# Altium project 主控板.PrjPCB
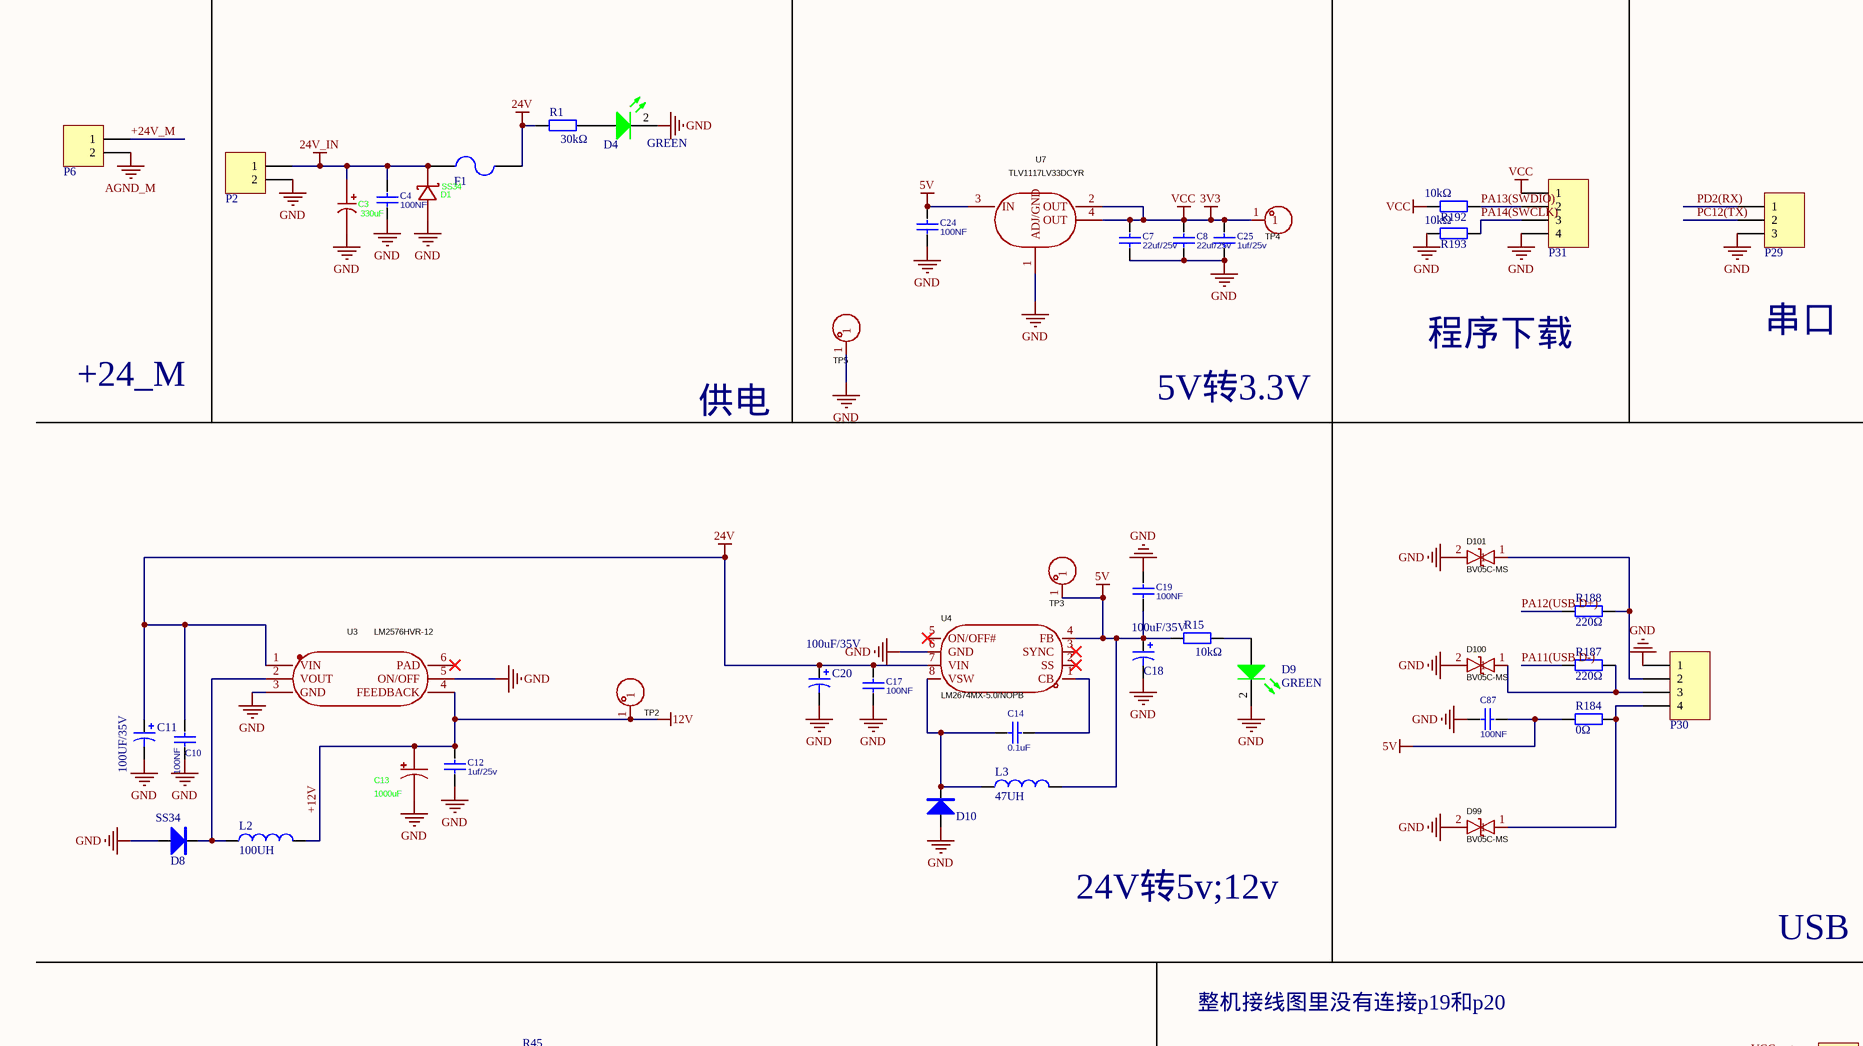
[diagram p0: 主控板0413.SchDoc, top left]
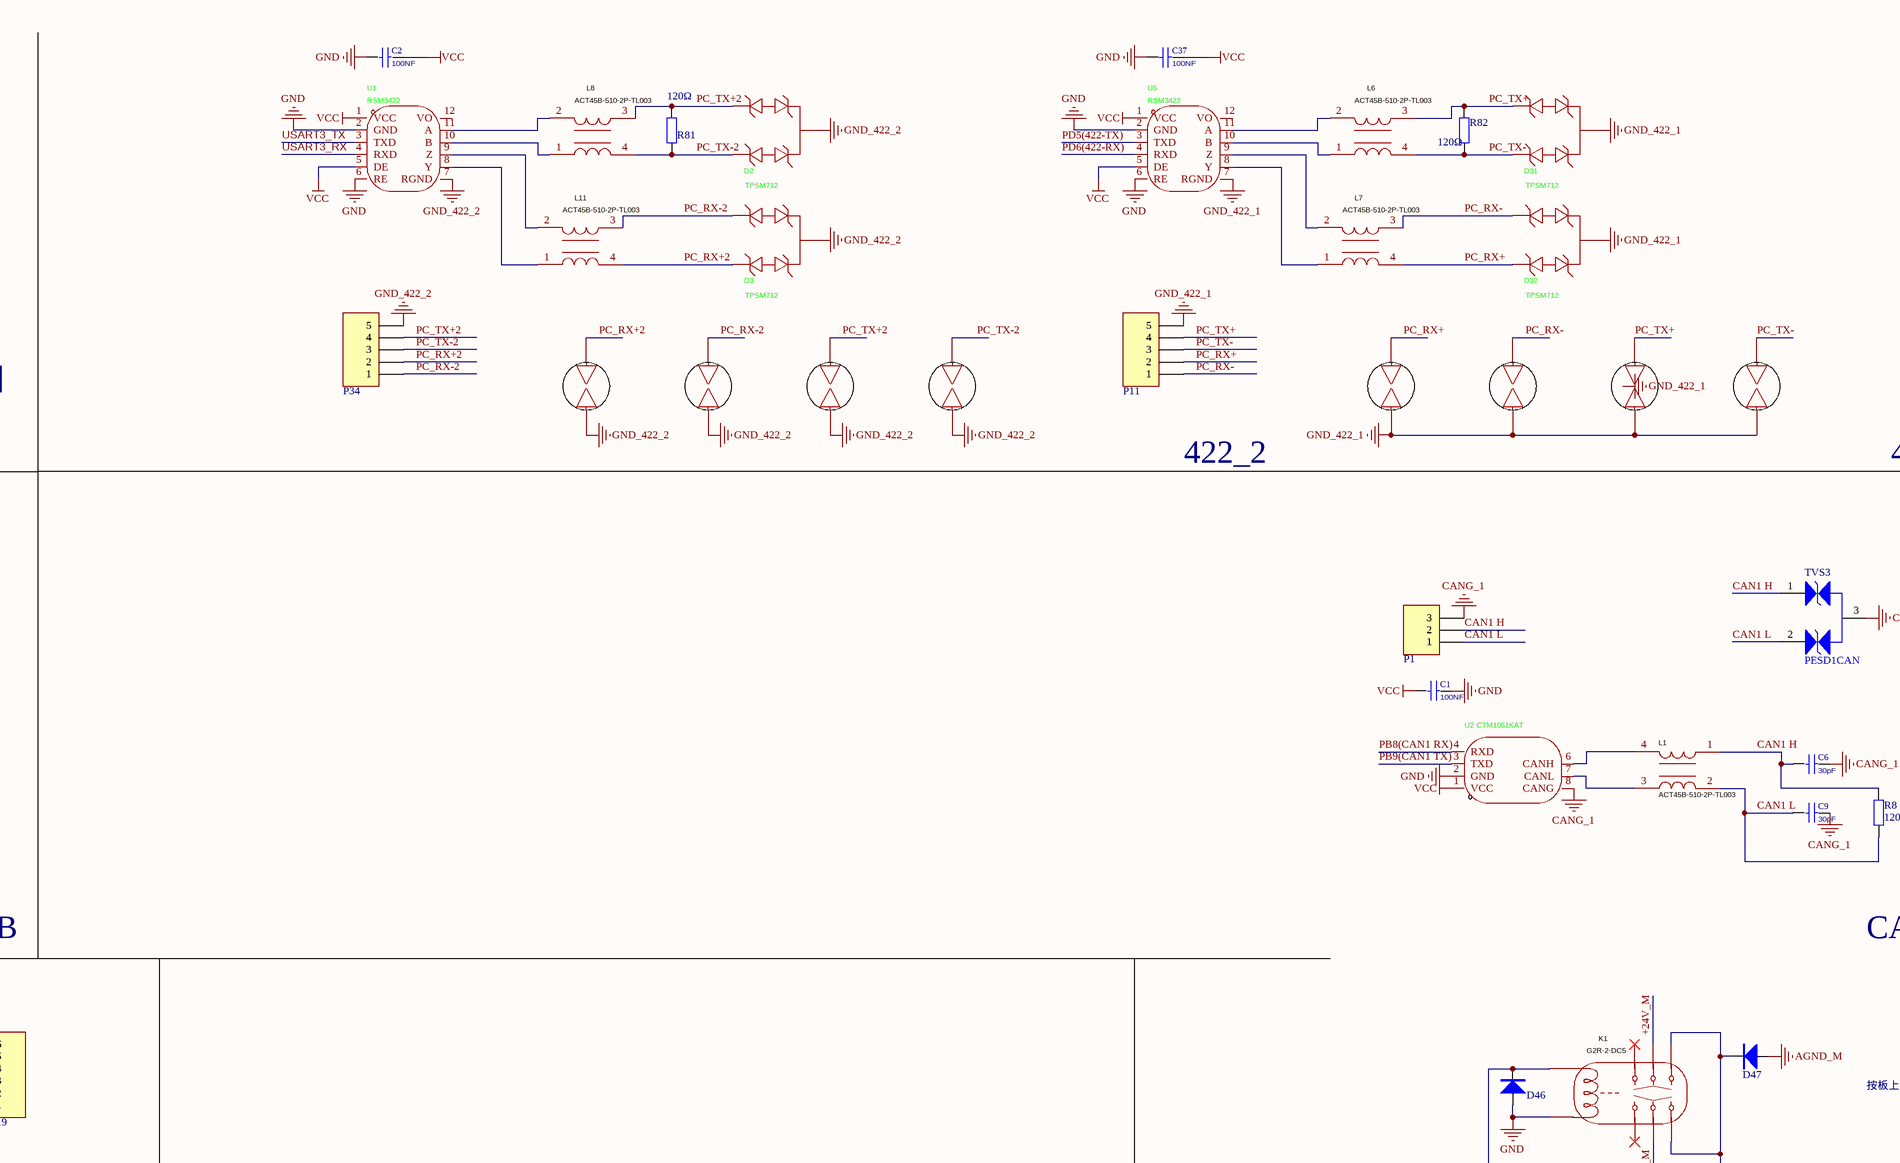
[diagram p1: 主控板0413.SchDoc, top middle]
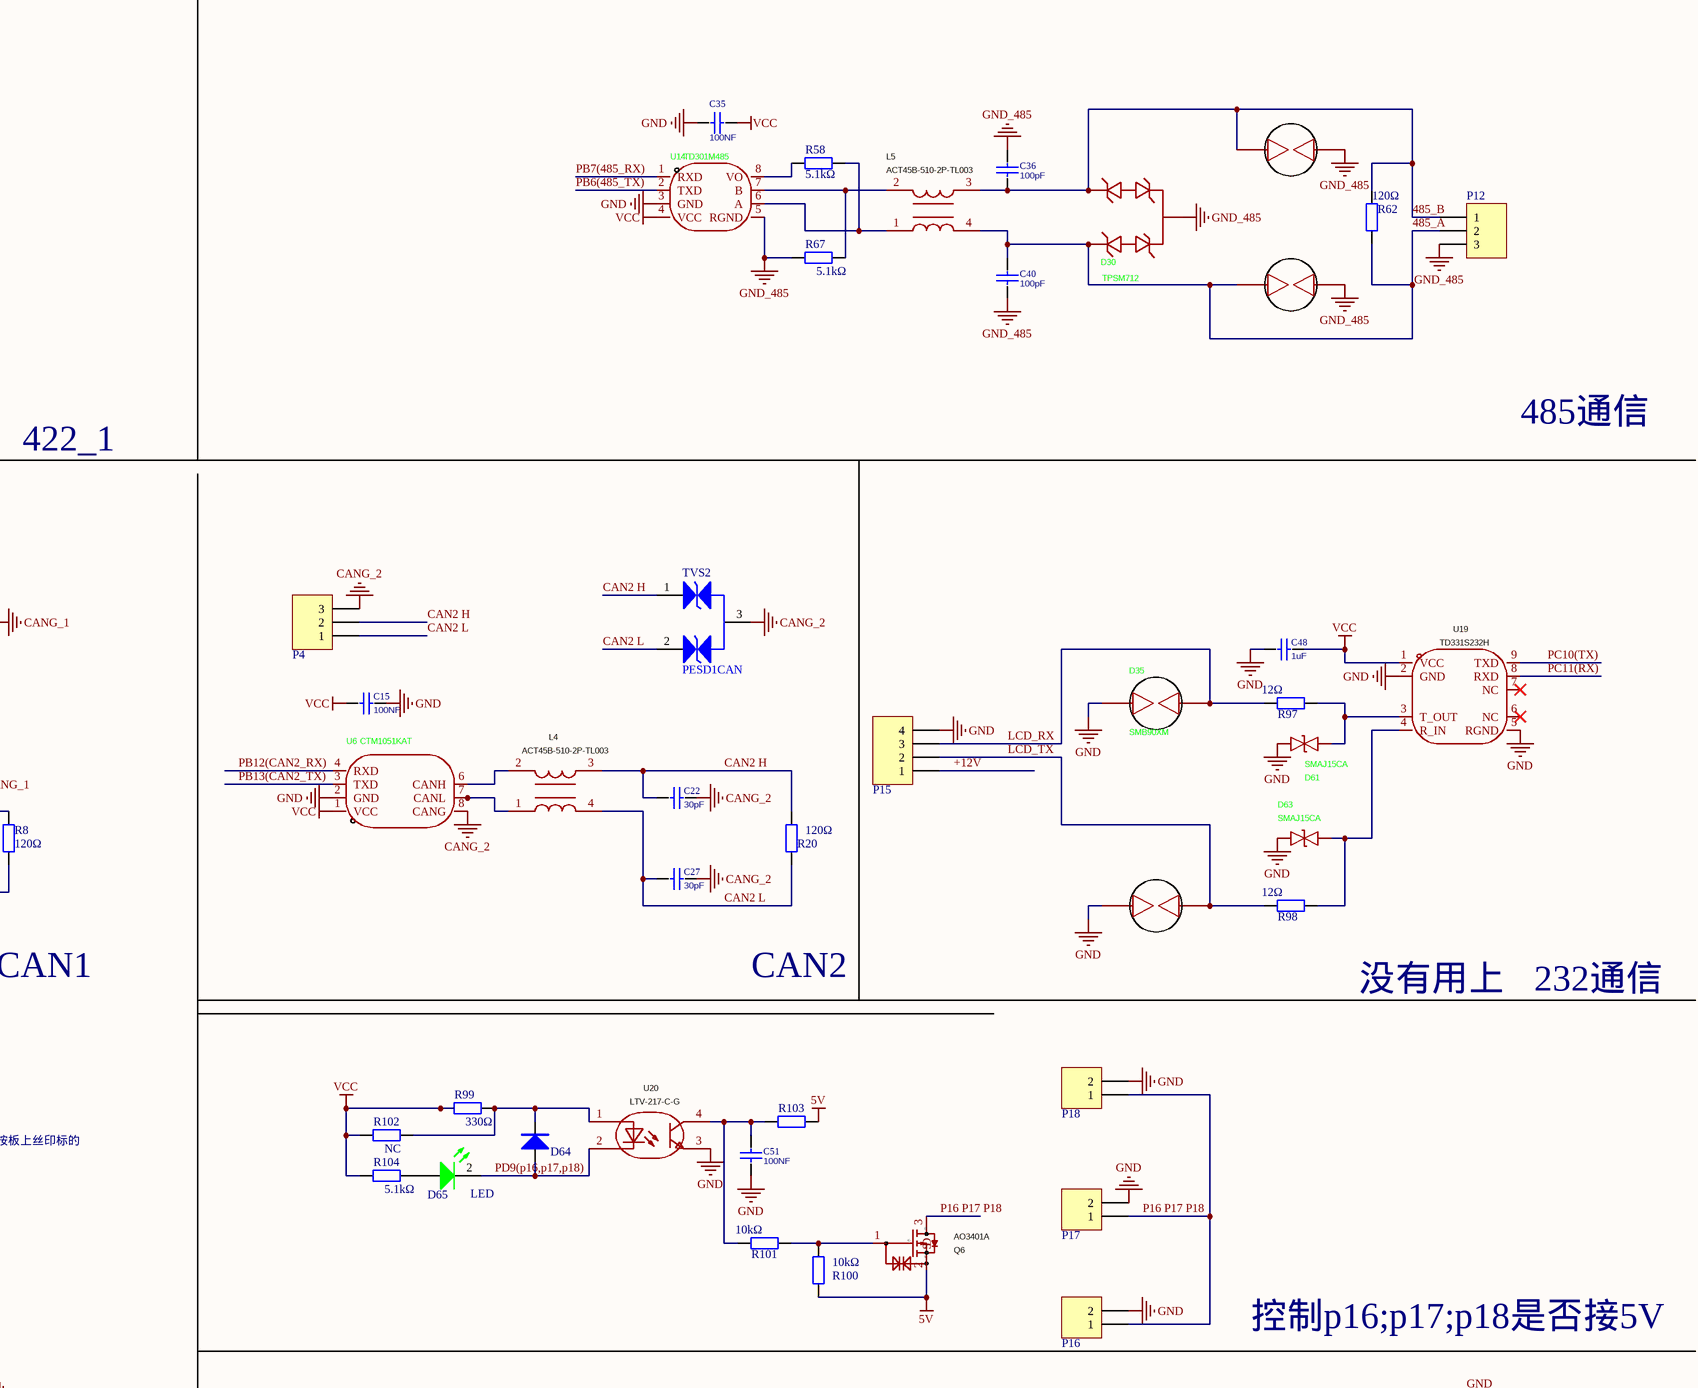
[diagram p2: 主控板0413.SchDoc, top right]
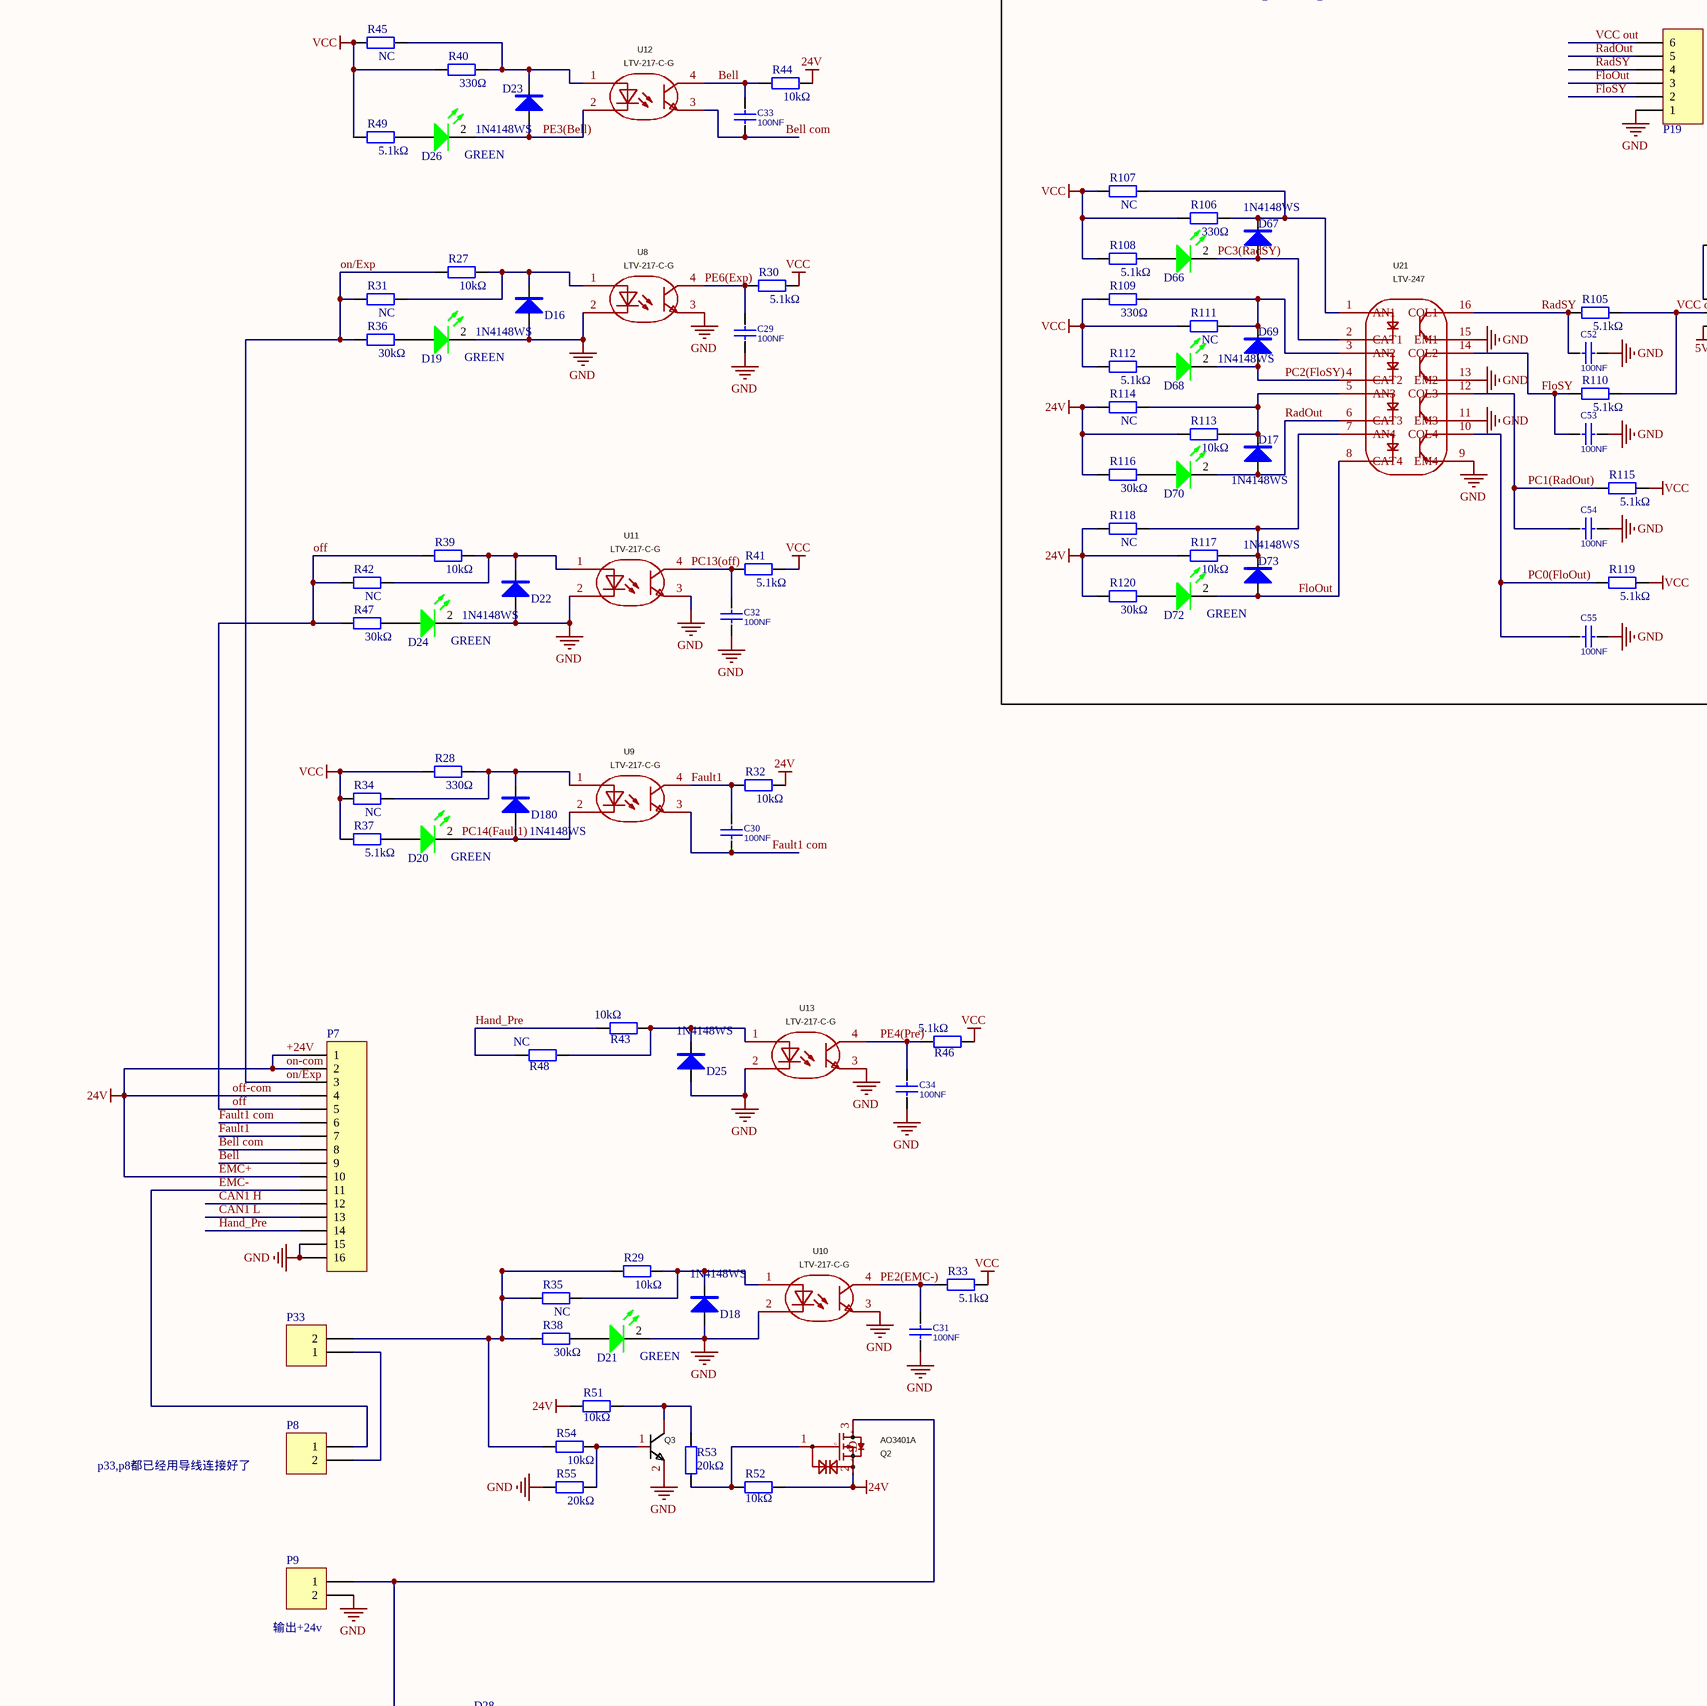
[diagram p3: 主控板0413.SchDoc, centre left]
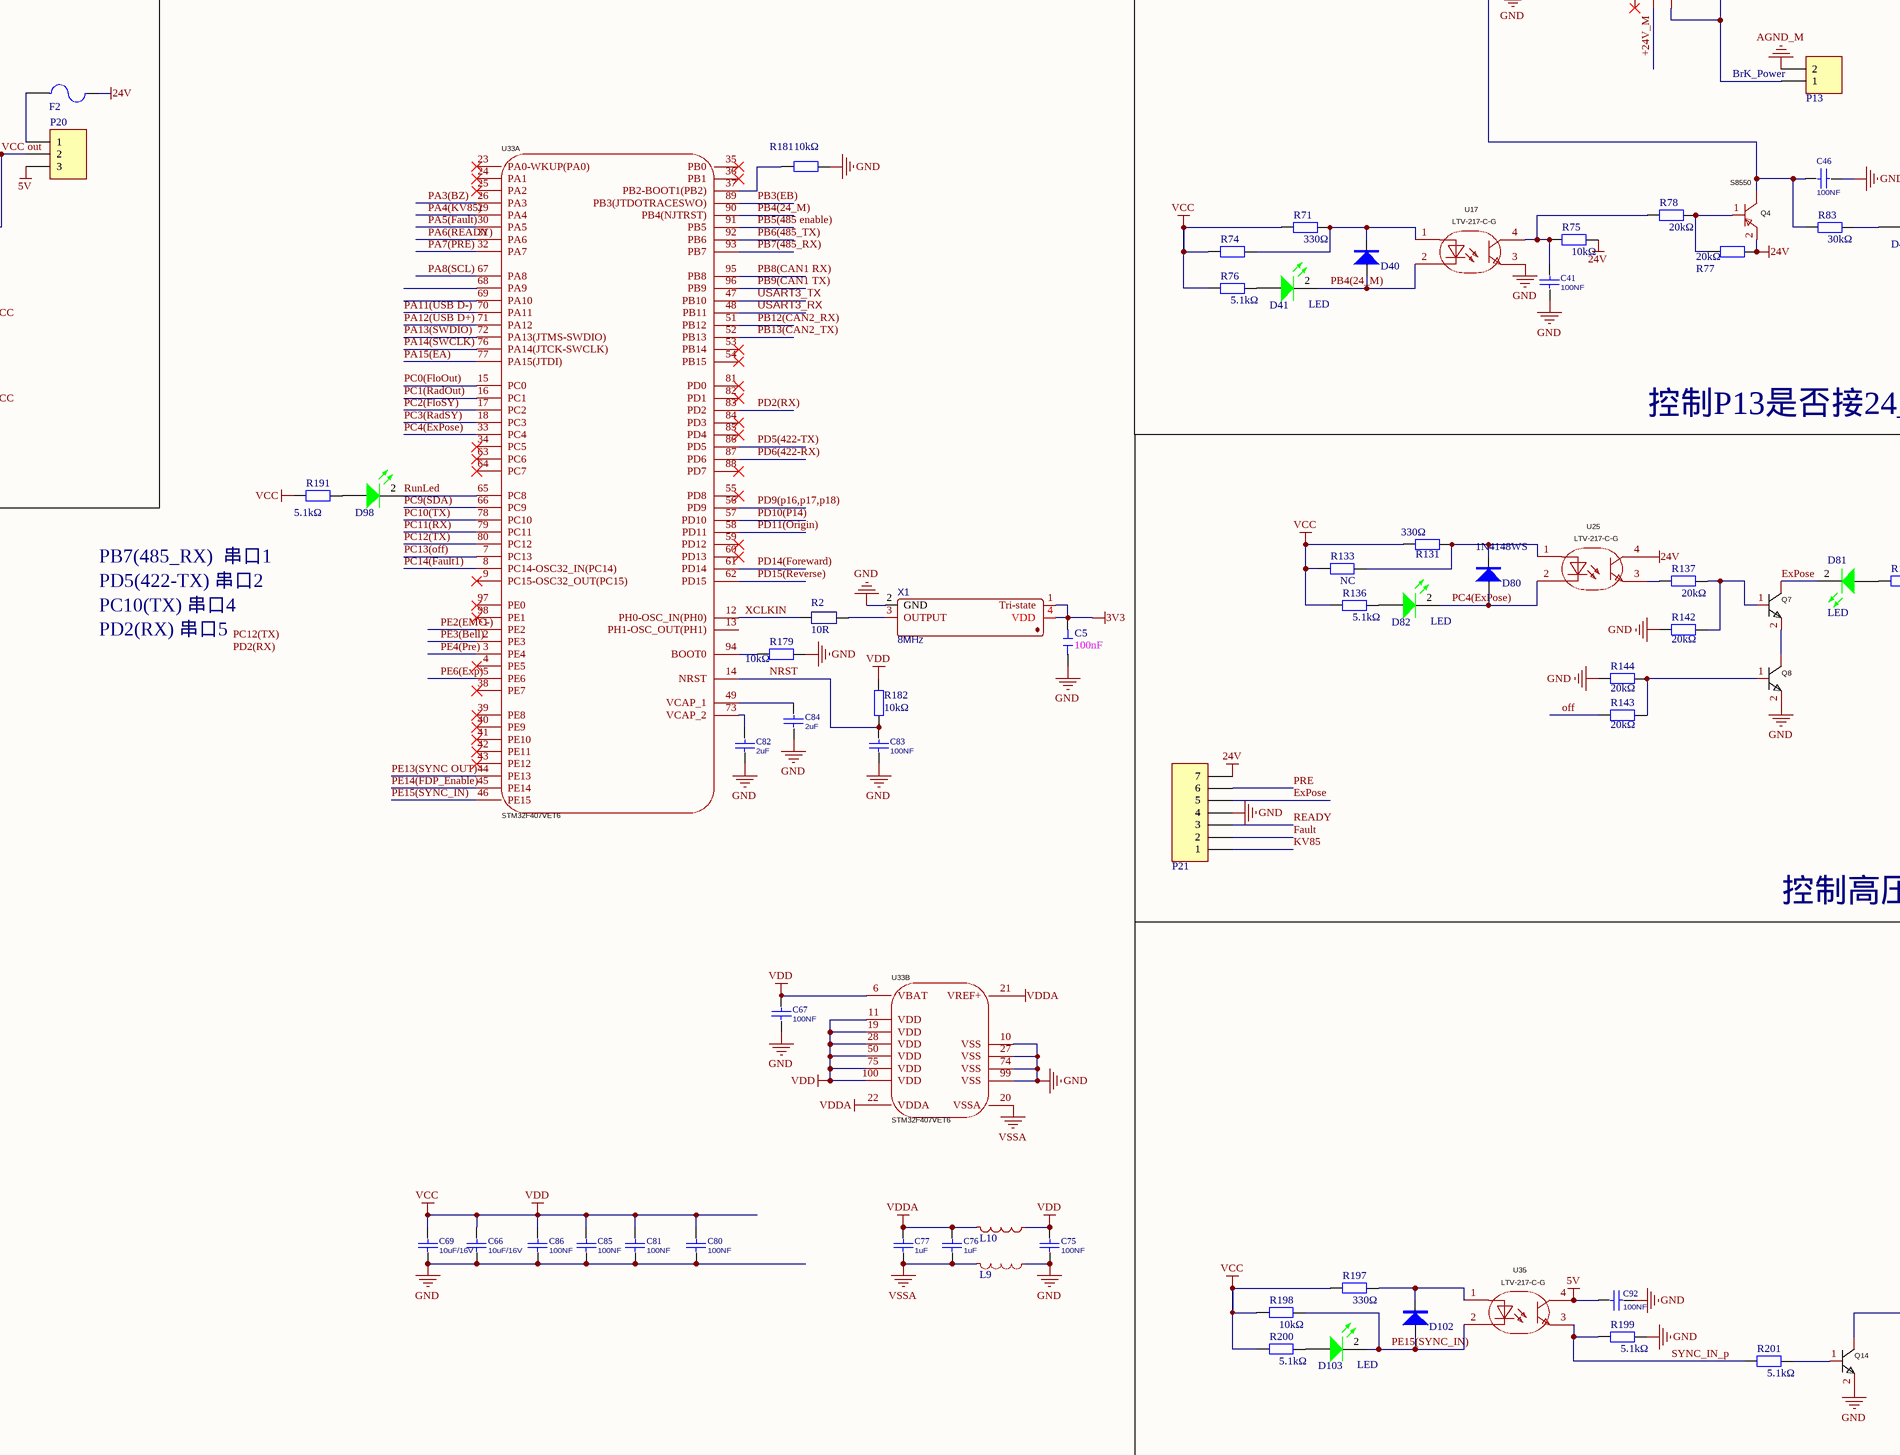
[diagram p4: 主控板0413.SchDoc, centre middle]
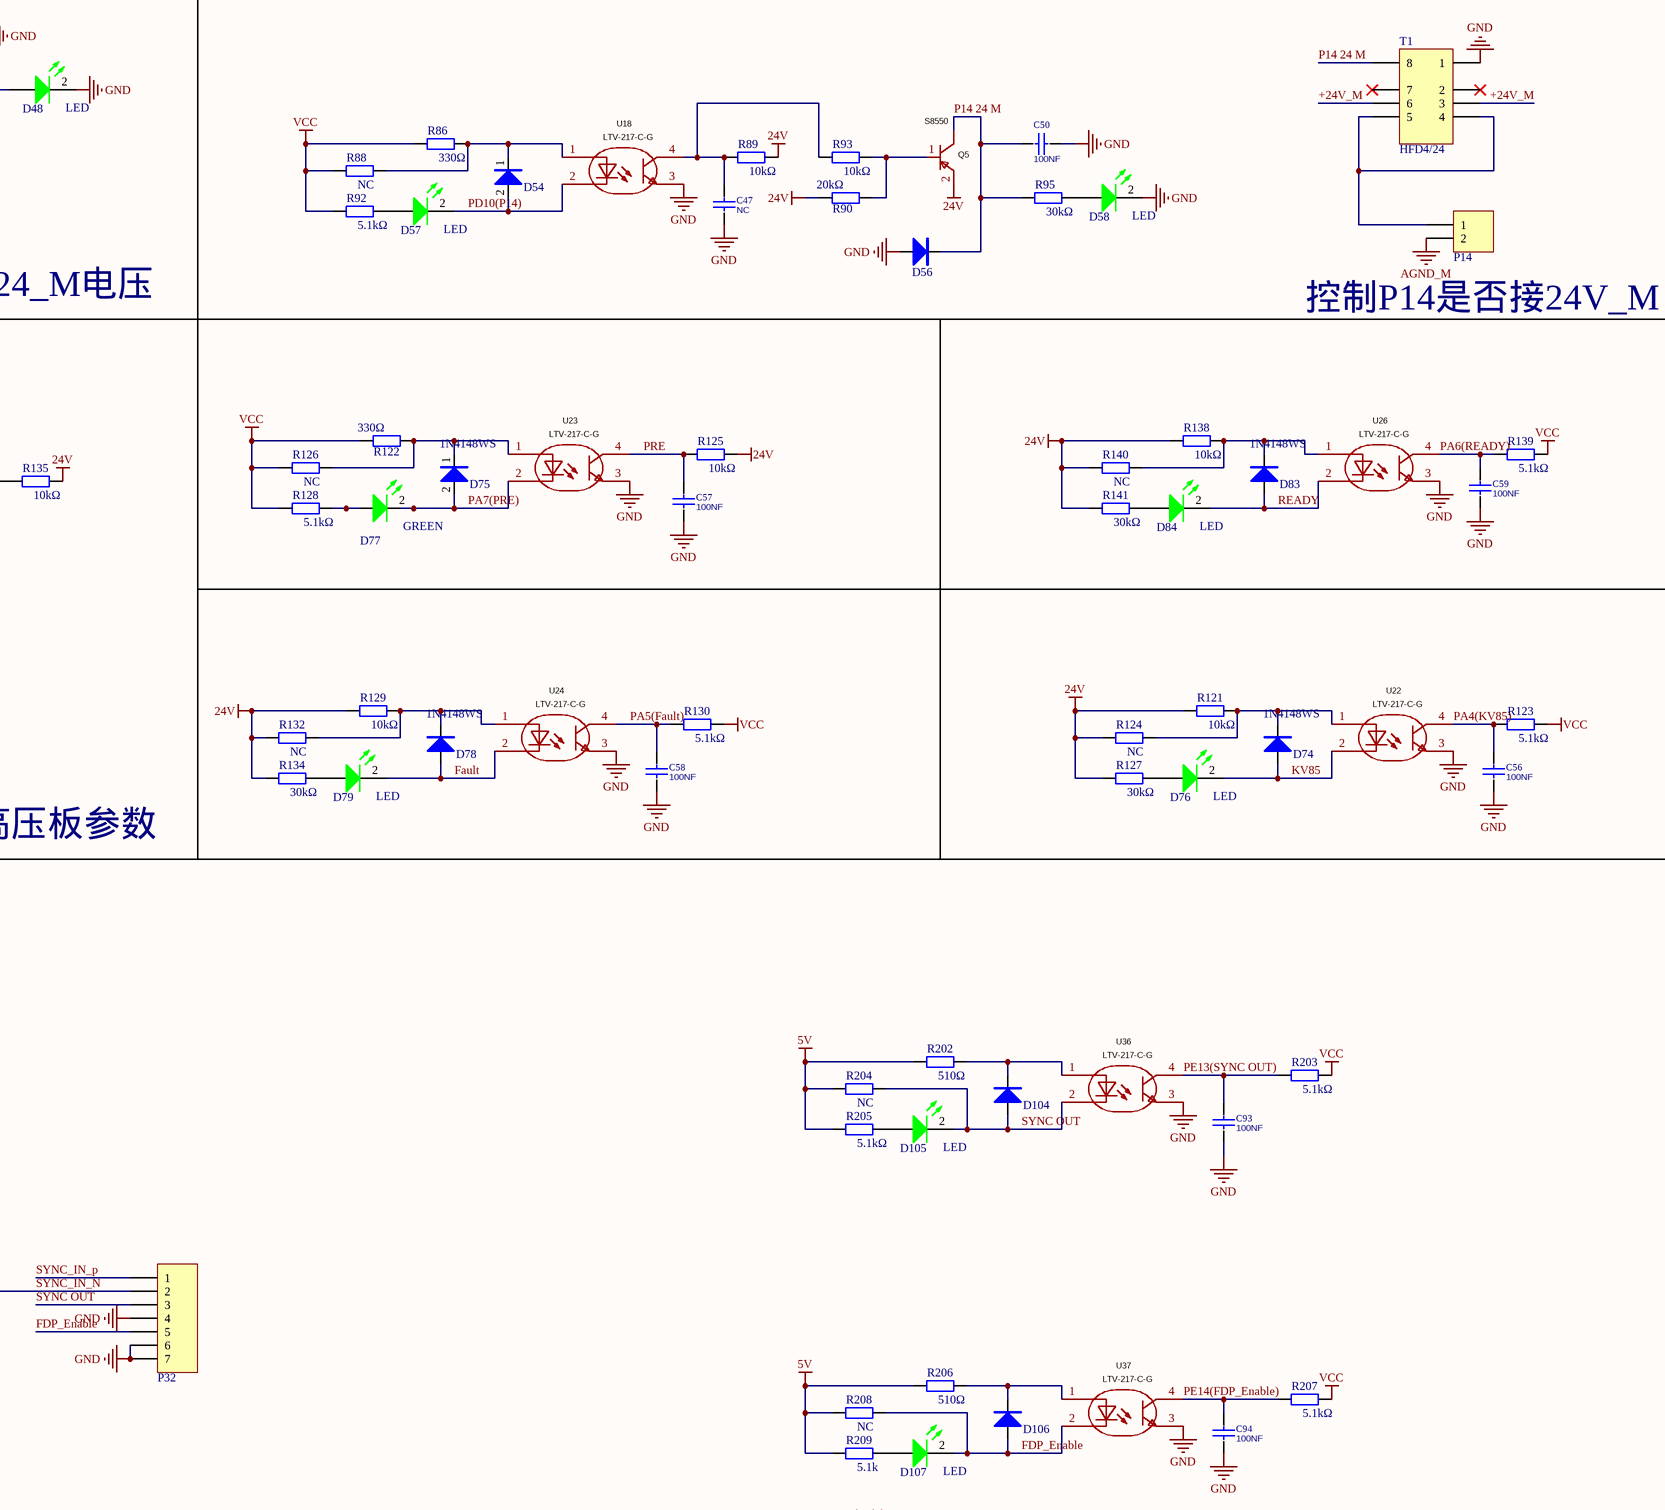
[diagram p5: 主控板0413.SchDoc, centre right]
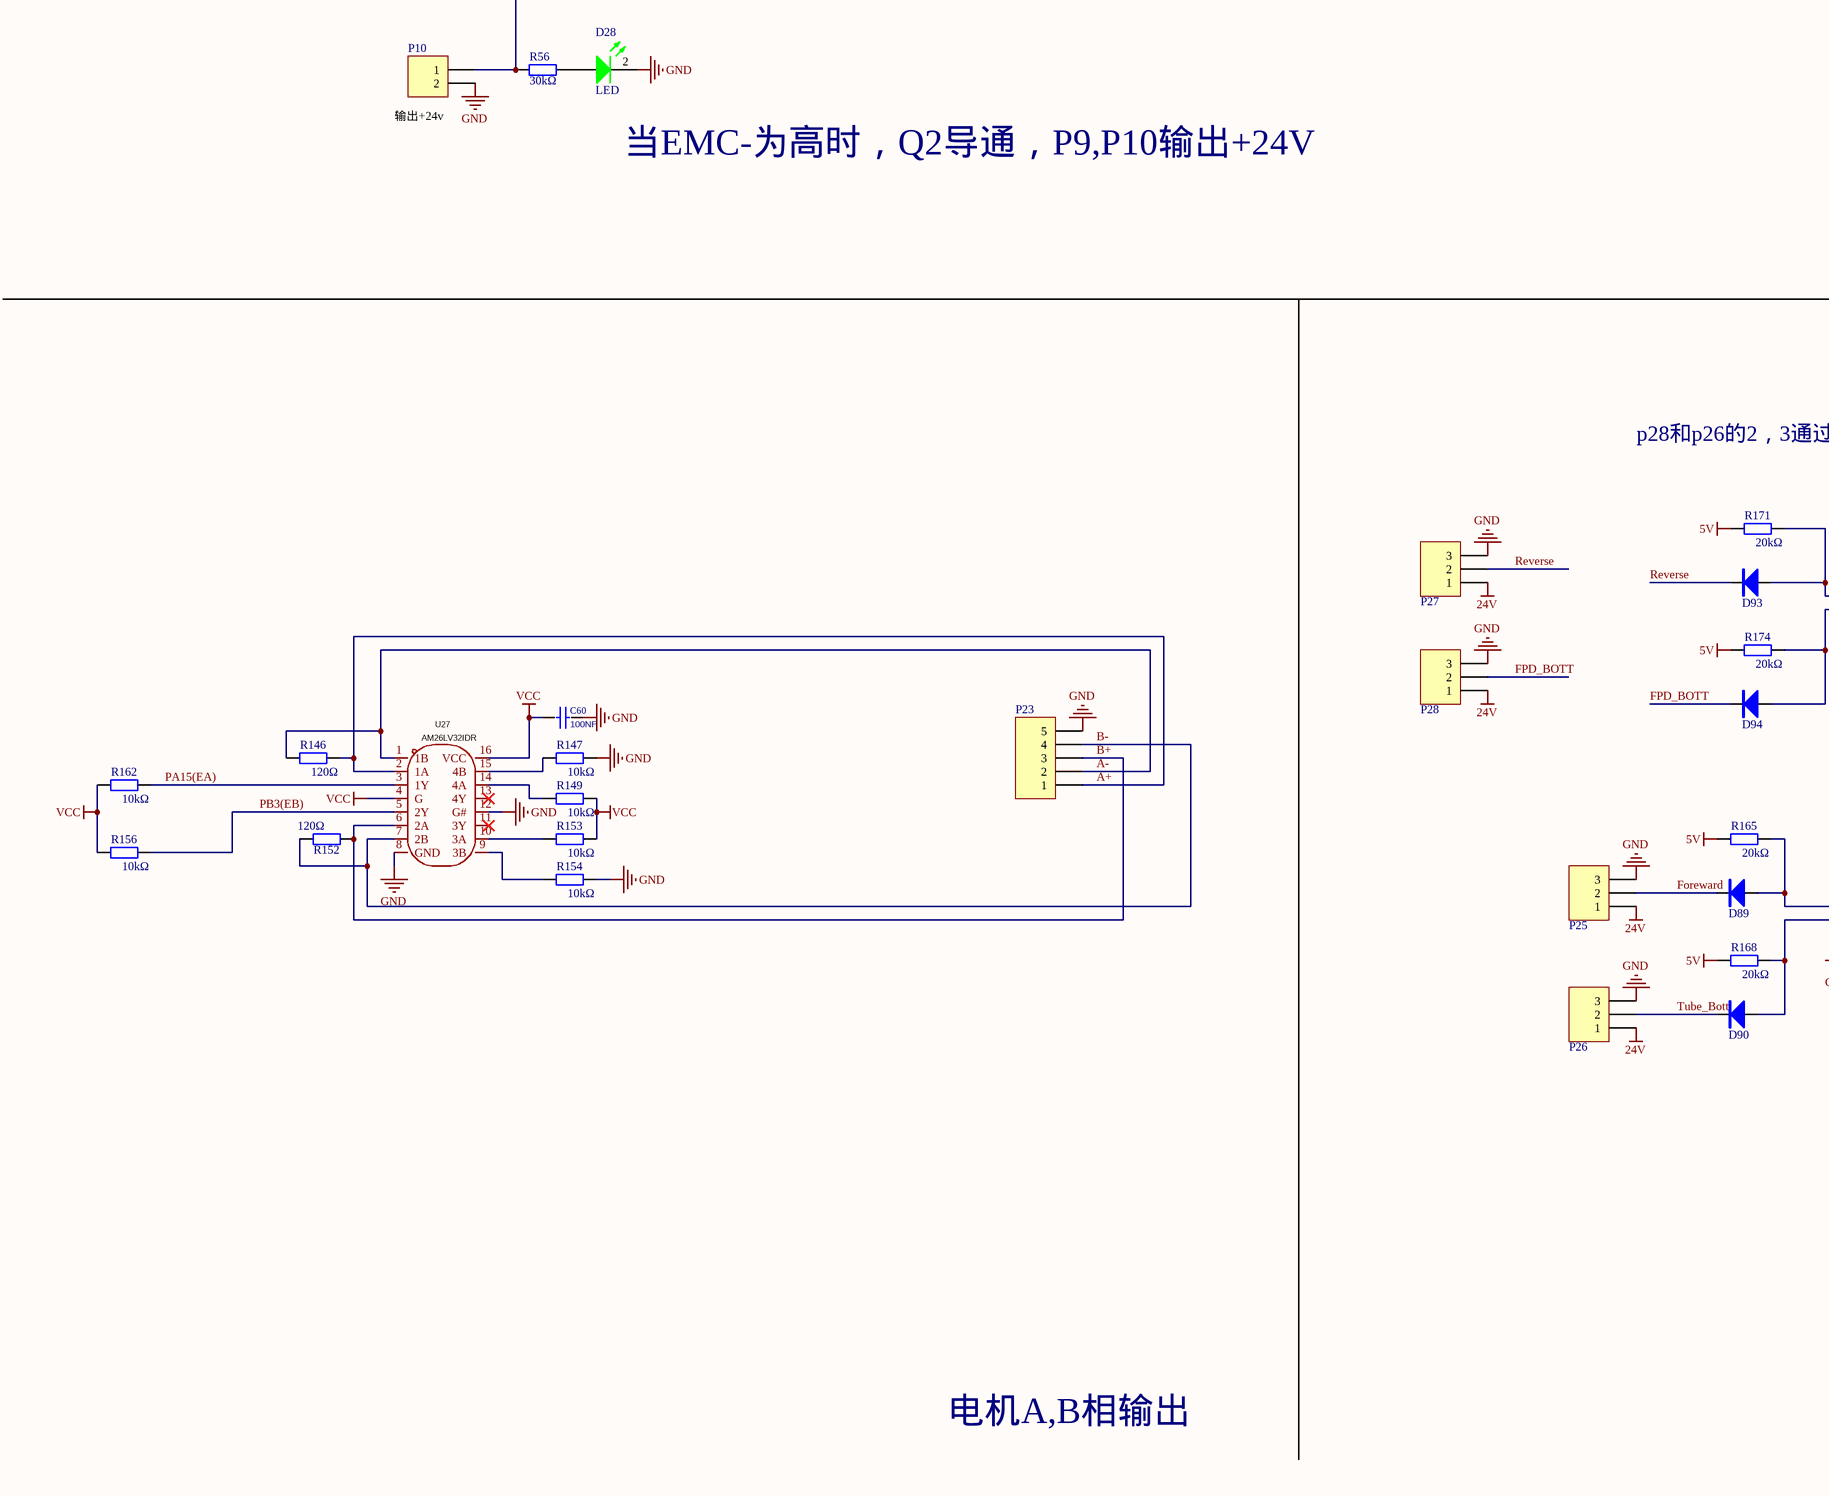
[diagram p6: 主控板0413.SchDoc, bottom left]
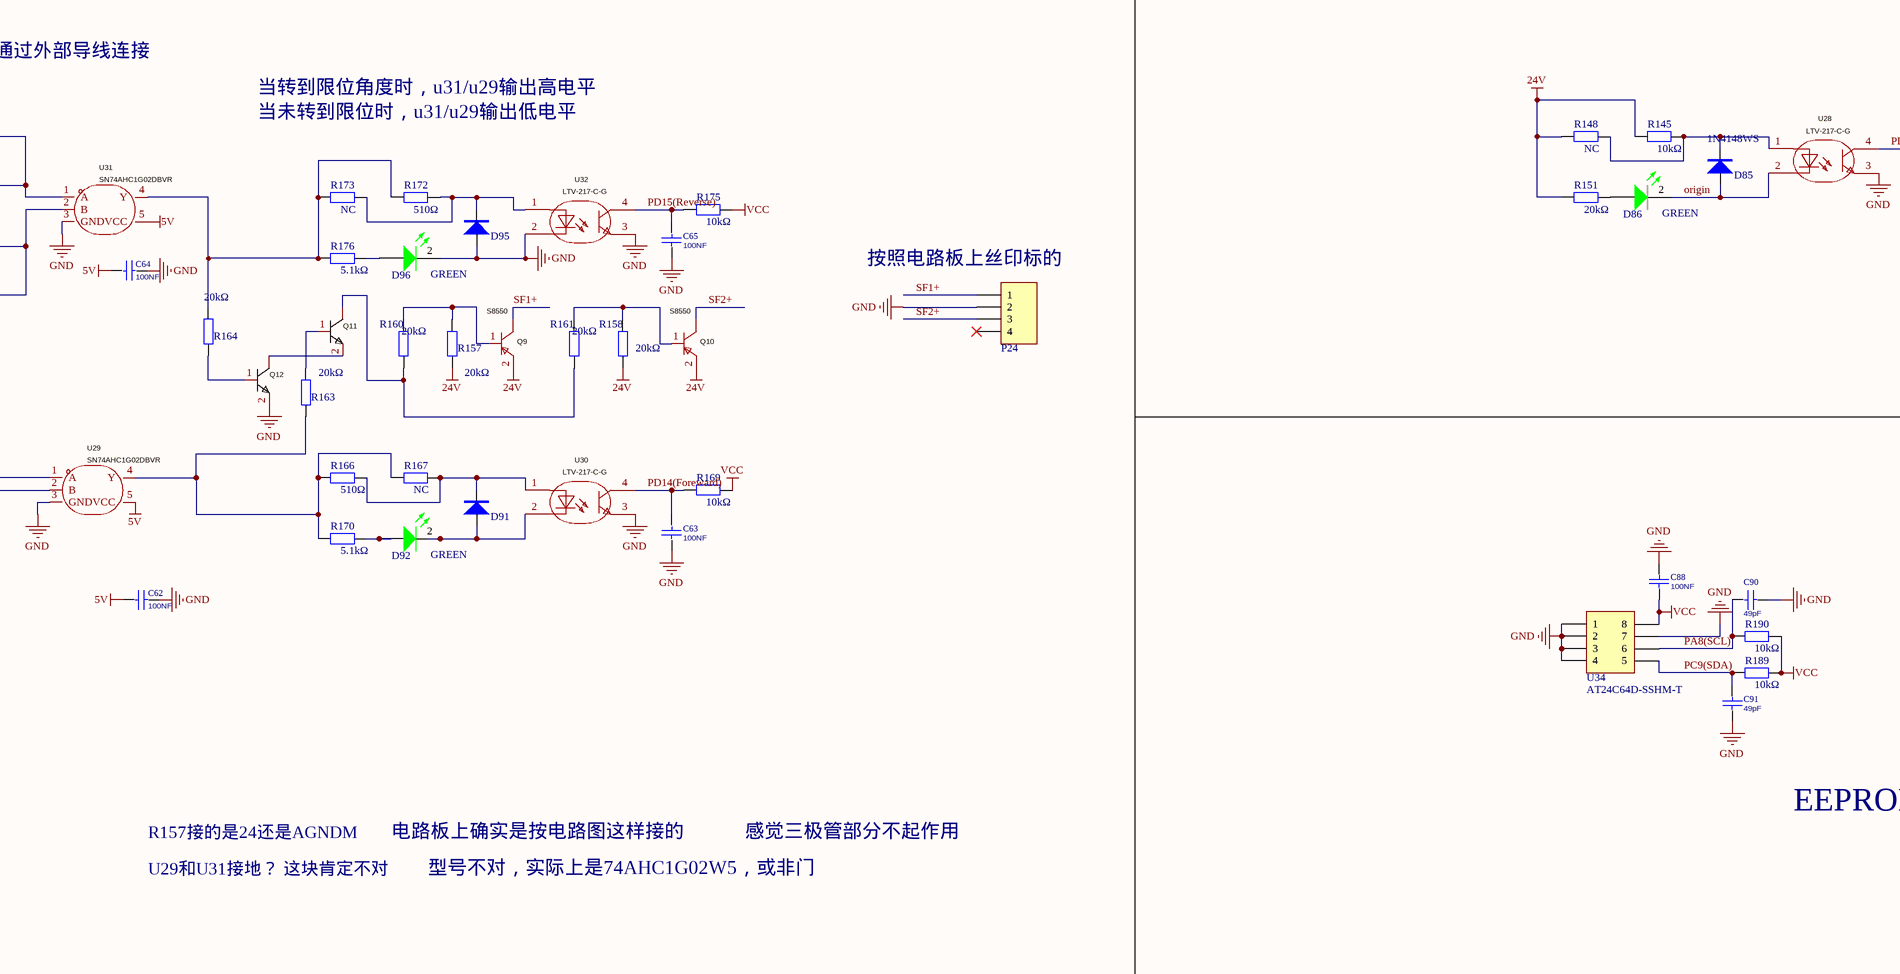
[diagram p7: 主控板0413.SchDoc, bottom middle]
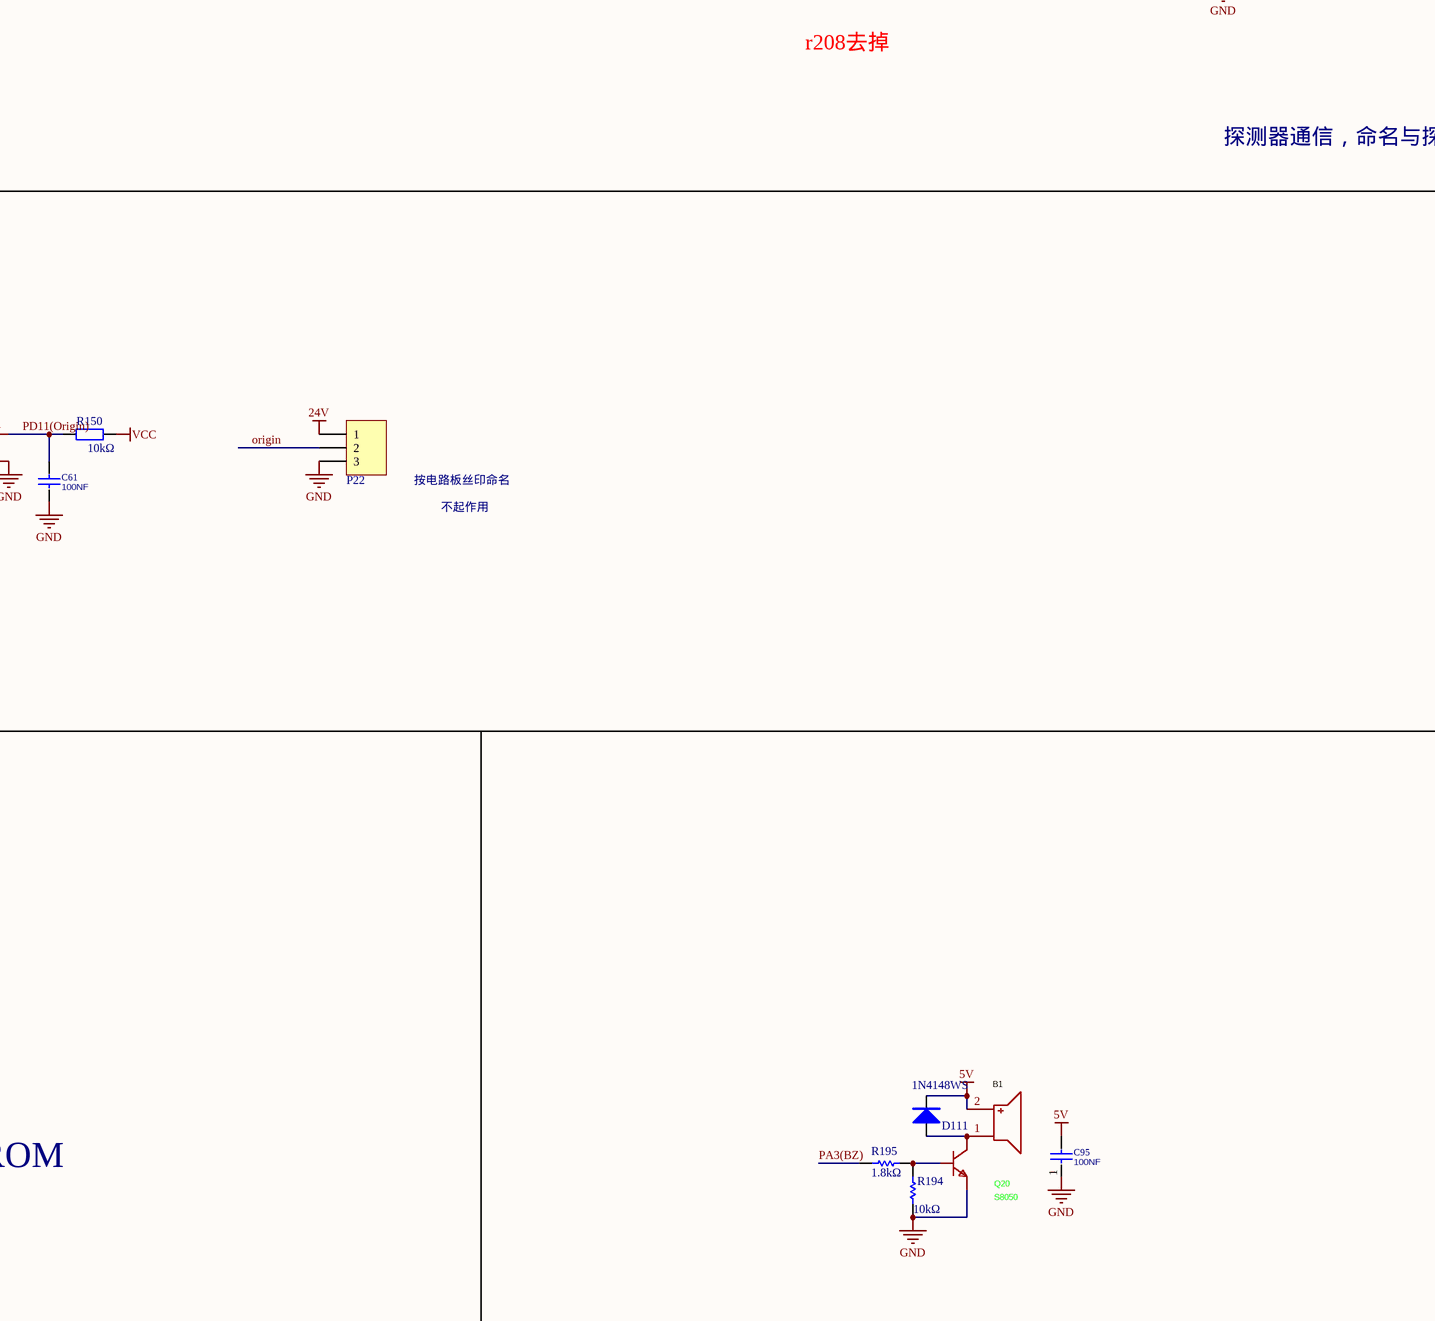
[diagram p8: 主控板0413.SchDoc, bottom right]
1 sheet, 421 parts. Net scope: global (net labels, ports and power ports of the same name join across sheets).
Board file: 主控板0415 .PcbDoc

## Sheet 主控板0413.SchDoc
size E

### Parts
B1  (no value)  [CPA5]
C1  100NF  [C0603]
C2  100NF  [C0603]
C3  330uF  [CAP-TH_BD8.0-P3.50-D0.5-FD]
C4  100NF  [C1206]
C5  100nF  [C0603]
C6  30pF  [C0603]
C7  22uf/25v  [C0805]
C8  22uf/25v  [C0805]
C9  30pF  [C0603]
C10  100NF  [C0603]
C11  100UF/35V  [CAP10]
C12  1uf/25v  [C0603]
C13  1000uF  [CAP-TH_BD10.0-P5.00-D1.0-FD]
C14  0.1uF  [C0603]
C15  100NF  [C0603]
C17  100NF  [C1206]
C18  100uF/35V  [CAP10]
C19  100NF  [C0603]
C20  100uF/35V  [CAP10]
C22  30pF  [C0603]
C24  100NF  [C0603]
C25  1uf/25v  [C0603]
C27  30pF  [C0603]
C29  100NF  [C0603]
C30  100NF  [C0603]
C31  100NF  [C0603]
C32  100NF  [C0603]
C33  100NF  [C0603]
C34  100NF  [C0603]
C35  100NF  [C0603]
C36  100pF  [C0603]
C37  100NF  [C0603]
C40  100pF  [C0603]
C41  100NF  [C0603]
C46  100NF  [C0603]
C47  NC  [C0603]
C48  1uF  [C0603]
C50  100NF  [C0603]
C51  100NF  [C0603]
C52  100NF  [C0603]
C53  100NF  [C0603]
C54  100NF  [C0603]
C55  100NF  [C0603]
C56  100NF  [C0603]
C57  100NF  [C0603]
C58  100NF  [C0603]
C59  100NF  [C0603]
C60  100NF  [C0603]
C61  100NF  [C0603]
C62  100NF  [C0603]
C63  100NF  [C0603]
C64  100NF  [C0603]
C65  100NF  [C0603]
C66  10uF/16V  [C0603]
C67  100NF  [C0603]
C69  10uF/16V  [C0603]
C75  100NF  [C0603]
C76  1uF  [C0603]
C77  1uF  [C0603]
C80  100NF  [C0603]
C81  100NF  [C0603]
C82  2uF  [C0603]
C83  100NF  [C0603]
C84  2uF  [C0603]
C85  100NF  [C0603]
C86  100NF  [C0603]
C87  100NF  [C0603]
C88  100NF  [C0603]
C90  49pF  [C0603]
C91  49pF  [C0603]
C92  100NF  [C0603]
C93  100NF  [C0603]
C94  100NF  [C0603]
C95  100NF  [C0603]
D1  SS34  [SMA_L4.3-W2.6-LS5.2-RD]
D2  TPSM712  [SOT-23-3_L2.9-W1.3-P1.90-LS2.4-BR]
D3  TPSM712  [SOT-23-3_L2.9-W1.3-P1.90-LS2.4-BR]
D4  GREEN  [LED0603]
D5  SMB90XM  [DIO-DT-SMD_L3.2-W1.6]  (value not drawn)
D6  SMB90XM  [DIO-DT-SMD_L3.2-W1.6]  (value not drawn)
D7  SMB90XM  [DIO-DT-SMD_L3.2-W1.6]  (value not drawn)
D8  SS34  [SMA]
D9  GREEN  [LED0603]
D10  SS34  [SMA]  (value not drawn)
D11  SMB90XM  [DIO-DT-SMD_L3.2-W1.6]  (value not drawn)
D12  SMB90XM  [DIO-DT-SMD_L3.2-W1.6]  (value not drawn)
D14  SMB90XM  [DIO-DT-SMD_L3.2-W1.6]  (value not drawn)
D15  SMB90XM  [DIO-DT-SMD_L3.2-W1.6]  (value not drawn)
D16  1N4148WS  [D123-1]
D17  1N4148WS  [D123-1]
D18  1N4148WS  [D123-1]
D19  GREEN  [LED0603]
D20  GREEN  [LED0603]
D21  GREEN  [LED0603]
D22  1N4148WS  [D123-1]
D23  1N4148WS  [D123-1]
D24  GREEN  [LED0603]
D25  1N4148WS  [D123-1]
D26  GREEN  [LED0603]
D28  LED  [LED0603]
D29  SMB90XM  [DIO-DT-SMD_L3.2-W1.6]  (value not drawn)
D30  TPSM712  [SOT-23-3_L2.9-W1.3-P1.90-LS2.4-BR]
D31  TPSM712  [SOT-23-3_L2.9-W1.3-P1.90-LS2.4-BR]
D32  TPSM712  [SOT-23-3_L2.9-W1.3-P1.90-LS2.4-BR]
D33  SMB90XM  [DIO-DT-SMD_L3.2-W1.6]  (value not drawn)
D34  SMB90XM  [DIO-DT-SMD_L3.2-W1.6]  (value not drawn)
D35  SMB90XM  [DIO-DT-SMD_L3.2-W1.6]
D36  SMB90XM  [DIO-DT-SMD_L3.2-W1.6]  (value not drawn)
D40  M7  [D123-1]  (value not drawn)
D41  LED  [LED0603]
D46  M7  [D123-1]  (value not drawn)
D47  M7  [SMA]  (value not drawn)
D48  LED  [LED0603]
D54  M7  [D123-1]  (value not drawn)
D56  M7  [D123-1]  (value not drawn)
D57  LED  [LED0603]
D58  LED  [LED0603]
D61  SMAJ15CA  [SMA_L4.3-W2.6-LS5.0-BI]
D63  SMAJ15CA  [SMA_L4.3-W2.6-LS5.0-BI]
D64  M7  [D123-1]  (value not drawn)
D65  LED  [LED0603]
D66  GREEN  [LED0603]  (value not drawn)
D67  1N4148WS  [D123-1]
D68  GREEN  [LED0603]  (value not drawn)
D69  1N4148WS  [D123-1]
D70  GREEN  [LED0603]  (value not drawn)
D72  GREEN  [LED0603]
D73  1N4148WS  [D123-1]
D74  1N4148WS  [D123-1]
D75  1N4148WS  [D123-1]
D76  LED  [LED0603]
D77  GREEN  [LED0603]
D78  1N4148WS  [D123-1]
D79  LED  [LED0603]
D80  1N4148WS  [D123-1]
D81  LED  [LED0603]
D82  LED  [LED0603]
D83  1N4148WS  [D123-1]
D84  LED  [LED0603]
D85  1N4148WS  [D123-1]
D86  GREEN  [LED0603]
D89  M7  [D123-1]  (value not drawn)
D90  M7  [D123-1]  (value not drawn)
D91  M7  [D123-1]  (value not drawn)
D92  GREEN  [LED0603]
D93  M7  [D123-1]  (value not drawn)
D94  M7  [D123-1]  (value not drawn)
D95  M7  [D123-1]  (value not drawn)
D96  GREEN  [LED0603]
D98  GREEN  [LED0603]  (value not drawn)
D99  BV05C-MS  [D123]
D100  BV05C-MS  [D123]
D101  BV05C-MS  [D123]
D102  M7  [D123-1]  (value not drawn)
D103  LED  [LED0603]
D104  M7  [D123-1]  (value not drawn)
D105  LED  [LED0603]
D106  M7  [D123-1]  (value not drawn)
D107  LED  [LED0603]
D111  1N4148WS  [D123-1]
D180  1N4148WS  [D123-1]
F1  Fuse 2  [D2120]  (value not drawn)
F2  Fuse 2  [D2120]  (value not drawn)
K1  G2R-2-DC5  [K1]
L1  ACT45B-510-2P-TL003  [L1206-6]
L2  100UH  [L-C54]
L3  47UH  [LC]
L4  ACT45B-510-2P-TL003  [L1206-6]
L5  ACT45B-510-2P-TL003  [L1206-6]
L6  ACT45B-510-2P-TL003  [L1206-6]
L7  ACT45B-510-2P-TL003  [L1206-6]
L8  ACT45B-510-2P-TL003  [L1206-6]
L9  BPH853025R5-101T  [L0603]  (value not drawn)
L10  BPH853025R5-101T  [L0603]  (value not drawn)
L11  ACT45B-510-2P-TL003  [L1206-6]
P1  Header 3  [254-3P]  (value not drawn)
P2  Header 2  [JPP1]  (value not drawn)
P4  Header 3  [254-3P]  (value not drawn)
P6  Header 2  [JPP1]  (value not drawn)
P7  Header 16  [254-16P]  (value not drawn)
P8  Header 2  [254-2P]  (value not drawn)
P9  Header 2  [254-2P]  (value not drawn)
P10  Header 2  [254-2P]  (value not drawn)
P11  Header 5  [254-5P]  (value not drawn)
P12  Header 3  [254-3P]  (value not drawn)
P13  Header 2  [JPP1]  (value not drawn)
P14  Header 2  [254-2P]  (value not drawn)
P15  Header 4  [254-4P]  (value not drawn)
P16  Header 2  [254-2P]  (value not drawn)
P17  Header 2  [254-2P]  (value not drawn)
P18  Header 2  [254-2P]  (value not drawn)
P19  Header 6  [254-6P]  (value not drawn)
P20  Header 3  [2.54-3P]  (value not drawn)
P21  Header 7  [254-7P]  (value not drawn)
P22  Header 3  [254-3P]  (value not drawn)
P23  Header 5  [254-5P]  (value not drawn)
P24  Header 4H  [254-4P]  (value not drawn)
P25  Header 3  [254-3P]  (value not drawn)
P26  Header 3  [254-3P]  (value not drawn)
P27  Header 3  [254-3P]  (value not drawn)
P28  Header 3  [254-3P]  (value not drawn)
P29  Header 3  [2.54-3P]  (value not drawn)
P30  Header 4  [USB-A]  (value not drawn)
P31  Header 4  [JP2]  (value not drawn)
P32  Header 7  [254-7P]  (value not drawn)
P33  Header 2  [254-2P]  (value not drawn)
P34  Header 5  [254-5P]  (value not drawn)
Q2  AO3401A  [SOT32-5]
Q3  Y1  [SOT32-5]  (value not drawn)
Q4  S8550  [SOT32-5]
Q5  S8550  [SOT32-5]
Q6  AO3401A  [SOT32-5]
Q7  Y1  [SOT32-5]  (value not drawn)
Q8  Y1  [SOT32-5]  (value not drawn)
Q9  S8550  [SOT32-5]
Q10  S8550  [SOT32-5]
Q11  Y1  [SOT32-5]  (value not drawn)
Q12  Y1  [SOT32-5]  (value not drawn)
Q14  Y1  [SOT32-5]  (value not drawn)
Q20  S8050  [SOT-23-3_L2.9-W1.3-P1.90-LS2.3-BR]
R1  30kΩ  [R0603]
R2  10R  [R0603]
R8  120Ω  [R0805]
R15  10kΩ  [R0603]
R20  120Ω  [R0805]
R27  10kΩ  [R0603]
R28  330Ω  [R0603]
R29  10kΩ  [R0603]
R30  5.1kΩ  [R0603]
R31  NC  [R0603]
R32  10kΩ  [R0603]
R33  5.1kΩ  [R0603]
R34  NC  [R0603]
R35  NC  [R0603]
R36  30kΩ  [R0603]
R37  5.1kΩ  [R0603]
R38  30kΩ  [R0603]
R39  10kΩ  [R0603]
R40  330Ω  [R0603]
R41  5.1kΩ  [R0603]
R42  NC  [R0603]
R43  10kΩ  [R0603]
R44  10kΩ  [R0603]
R45  NC  [R0603]
R46  5.1kΩ  [R0603]
R47  30kΩ  [R0603]
R48  NC  [R0603]
R49  5.1kΩ  [R0603]
R51  10kΩ  [R0603]
R52  10kΩ  [R0603]
R53  20kΩ  [R0603]
R54  10kΩ  [R0603]
R55  20kΩ  [R0603]
R56  30kΩ  [R0603]
R58  5.1kΩ  [R0603]
R62  120Ω  [R0805]
R67  5.1kΩ  [R0603]
R71  330Ω  [R0603]
R74  15P101R  [R0603]  (value not drawn)
R75  10kΩ  [R0603]
R76  5.1kΩ  [R0603]
R77  20kΩ  [R0603]
R78  20kΩ  [R0603]
R81  120Ω  [R0805]
R82  120Ω  [R0805]
R83  30kΩ  [R0603]
R86  330Ω  [R0603]
R88  NC  [R0603]
R89  10kΩ  [R0603]
R90  20kΩ  [R0603]
R92  5.1kΩ  [R0603]
R93  10kΩ  [R0603]
R95  30kΩ  [R0603]
R97  12Ω  [R0805]
R98  12Ω  [R0805]
R99  330Ω  [R0603]
R100  10kΩ  [R0603]
R101  10kΩ  [R0603]
R102  NC  [R0603]
R103  10kΩ  [R0603]  (value not drawn)
R104  5.1kΩ  [R0603]
R105  5.1kΩ  [R0603]
R106  330Ω  [R0603]
R107  NC  [R0603]
R108  5.1kΩ  [R0603]
R109  330Ω  [R0603]
R110  5.1kΩ  [R0603]
R111  NC  [R0603]
R112  5.1kΩ  [R0603]
R113  10kΩ  [R0603]
R114  NC  [R0603]
R115  5.1kΩ  [R0603]
R116  30kΩ  [R0603]
R117  10kΩ  [R0603]
R118  NC  [R0603]
R119  5.1kΩ  [R0603]
R120  30kΩ  [R0603]
R121  10kΩ  [R0603]
R122  330Ω  [R0805]
R123  5.1kΩ  [R0603]
R124  NC  [R0603]
R125  10kΩ  [R0603]
R126  NC  [R0603]
R127  30kΩ  [R0603]
R128  5.1kΩ  [R0603]
R129  10kΩ  [R0603]
R130  5.1kΩ  [R0603]
R131  330Ω  [R0805]
R132  NC  [R0603]
R133  NC  [R0603]
R134  30kΩ  [R0603]
R135  10kΩ  [R0603]
R136  5.1kΩ  [R0603]
R137  20kΩ  [R0603]
R138  10kΩ  [R0603]
R139  5.1kΩ  [R0603]
R140  NC  [R0603]
R141  30kΩ  [R0603]
R142  20kΩ  [R0603]
R143  20kΩ  [R0603]
R144  20kΩ  [R0603]
R145  10kΩ  [R0603]
R146  120Ω  [R0603]
R147  10kΩ  [R0603]
R148  NC  [R0603]
R149  10kΩ  [R0603]
R150  10kΩ  [R0603]
R151  20kΩ  [R0603]
R152  120Ω  [R0603]
R153  10kΩ  [R0603]
R154  10kΩ  [R0603]
R156  10kΩ  [R0603]
R157  20kΩ  [R0603]
R158  20kΩ  [R0603]
R160  20kΩ  [R0603]
R161  20kΩ  [R0603]
R162  10kΩ  [R0603]
R163  20kΩ  [R0603]
R164  20kΩ  [R0603]
R165  20kΩ  [R0603]
R166  510Ω  [R0603]
R167  NC  [R0603]
R168  20kΩ  [R0603]
R169  10kΩ  [R0603]
R170  5.1kΩ  [R0603]
R171  20kΩ  [R0603]
R172  510Ω  [R0603]
R173  NC  [R0603]
R174  20kΩ  [R0603]
R175  10kΩ  [R0603]
R176  5.1kΩ  [R0603]
R179  10kΩ  [R0603]
R181  10kΩ  [R0603]
R182  10kΩ  [R0603]
R184  0Ω  [R0603]
R187  220Ω  [R0603]
R188  220Ω  [R0603]
R189  10kΩ  [R0603]
R190  10kΩ  [R0603]
R191  5.1kΩ  [R0603]
R192  10kΩ  [R0603]
R193  10kΩ  [R0603]
R194  10kΩ  [R0603]
R195  1.8kΩ  [R0603]
R197  330Ω  [R0603]
R198  10kΩ  [R0603]
R199  5.1kΩ  [R0603]
R200  5.1kΩ  [R0603]
R201  5.1kΩ  [R0603]
R202  510Ω  [R0603]
R203  5.1kΩ  [R0603]
R204  NC  [R0603]
R205  5.1kΩ  [R0603]
R206  510Ω  [R0603]
R207  5.1kΩ  [R0603]
R208  NC  [R0603]
R209  5.1k  [R0603]
T1  HFD4/24  [JP1]
TP2  RH-5001  [TP]  (value not drawn)
TP3  RH-5001  [TP]  (value not drawn)
TP4  RH-5001  [TP]  (value not drawn)
TP5  RH-5001  [TP]  (value not drawn)
TVS2  PESD1CAN  [SOT-23-3_L2.9-W1.3-P1.90-LS2.3-BR]
TVS3  PESD1CAN  [SOT-23-3_L2.9-W1.3-P1.90-LS2.3-BR]
U1  RSM3422  [DIP-12_L19.5-W16.5-P2.54-LS12.7-BL]
U2  CTM1051KAT  [COMM-TH_CTM1051KAT]
U3  LM2576HVR-12  [TO5]
U4  LM2674MX-5.0/NOPB  [SOP-8]
U5  RSM3422  [DIP-12_L19.5-W16.5-P2.54-LS12.7-BL]
U6  CTM1051KAT  [COMM-TH_CTM1051KAT]
U7  TLV1117LV33DCYR  [TO9]
U8  LTV-217-C-G  [SOP-4]
U9  LTV-217-C-G  [SOP-4]
U10  LTV-217-C-G  [SOP-4]
U11  LTV-217-C-G  [SOP-4]
U12  LTV-217-C-G  [SOP-4]
U13  LTV-217-C-G  [SOP-4]
U14  TD301M485  [COMM-TH_TD301M485]
U17  LTV-217-C-G  [SOP-4]
U18  LTV-217-C-G  [SOP-4]
U19  TD331S232H  [U1]
U20  LTV-217-C-G  [SOP-4]
U21  LTV-247  [SOP16-1]
U22  LTV-217-C-G  [SOP-4]
U23  LTV-217-C-G  [SOP-4]
U24  LTV-217-C-G  [SOP-4]
U25  LTV-217-C-G  [SOP-4]
U26  LTV-217-C-G  [SOP-4]
U27  AM26LV32IDR  [SOP16]
U28  LTV-217-C-G  [SOP-4]
U29  SN74AHC1G02DBVR  [SOT32-6]
U30  LTV-217-C-G  [SOP-4]
U31  SN74AHC1G02DBVR  [SOT32-6]
U32  LTV-217-C-G  [SOP-4]
U33  STM32F407VET6  [100PIN]  (parts A,B of 2)
U34  AT24C64D-SSHM-T  [SOP-8]
U35  LTV-217-C-G  [SOP-4]
U36  LTV-217-C-G  [SOP-4]
U37  LTV-217-C-G  [SOP-4]
X1  8MHz  [OSC-SMD_4P-L5.0-W3.2-BL_SG5032]

### Nets
3V3: C1.1 C2.2 C5.1 C7.2 C8.2 C15.1 C25.2 C35.1 C37.2 C48.2 C60.1 C66.1 C67.1 C69.1 C75.2 C80.2 C81.2 C85.2 C86.2 C88.1 L10.1 P31.1 R28.2 R30.1 R33.1 R34.2 R37.2 R40.2 R41.1 R45.2 R46.2 R49.2 R71.2 R74.2 R76.2 R86.2 R88.2 R92.2 R99.2 R102.2 R104.2 R106.2 R107.2 R108.2 R109.2 R111.2 R112.2 R115.1 R119.1 R122.1 R123.1 R126.2 R128.2 R130.1 R131.1 R133.2 R136.2 R139.1 R149.1 R150.1 R153.1 R156.2 R162.2 R169.1 R175.1 R182.2 R189.1 R190.1 R191.1 R192.1 R197.2 R198.2 R200.2 R203.1 R207.1 TP4.1 U1.1(VCC) U1.5(DE) U2.1(VCC) U5.1(VCC) U5.5(DE) U6.1(VCC) U7.2(OUT) U7.4(OUT) U14.4(VCC) U19.1(VCC) U27.4(G) U27.16(VCC) U33.6(VBAT) U33.11(VDD) U33.19(VDD) U33.28(VDD) U33.50(VDD) U33.75(VDD) U33.100(VDD) U34.8 X1.1(Tri-state) X1.4(VDD)  [also labelled VCC, VDD]
5V: B1.2 C18.1 C19.2 C24.1 C62.1 C64.1 C87.2 C92.1 C95.2 D111.1 L3.2 P20.3 Q6.2(S) R15.2 R100.2 R103.1 R165.2 R168.2 R171.2 R174.2 R184.1 R202.2 R204.2 R205.2 R206.2 R208.2 R209.2 TP3.1 U4.4(FB) U7.3(IN) U29.5(VCC) U31.5(VCC) U35.4
24V_IN: C3.1 C4.1 D1.1(K) F1.2 P2.1
+12V: C12.2 C13.1 L2.2 P15.1 TP2.1 U3.4(FEEDBACK)  [also labelled 12V]
+24V: C10.1 C11.1 C17.1 C20.1 F1.1 F2.2 P7.1 P7.2 P7.4 P7.10 P21.7 P22.1 P25.1 P26.1 P27.1 P28.1 Q2.2(S) Q4.2(E) Q5.2(E) Q9.2(E) Q10.2(E) R1.2 R32.1 R44.1 R51.1 R52.2 R75.1 R77.1 R89.1 R90.1 R113.2 R114.2 R116.2 R117.2 R118.2 R120.2 R121.2 R124.2 R125.1 R127.2 R129.2 R132.2 R134.2 R135.1 R138.2 R140.2 R141.2 R145.2 R148.2 R151.2 R157.2 R158.2 U3.1(VIN) U4.7(VIN) U25.4  [also labelled 24V, EMC+, off-com, on-com]
AGND_M: D47.2 P6.2 P13.2 P14.2
CANG_1: C6.2 C9.2 P1.3 TVS3.3 U2.8(CANG)
CANG_2: C22.2 C27.2 P4.3 TVS2.3 U6.8(CANG)
GND: C1.2 C2.1 C3.2 C4.2 C5.2 C7.1 C8.1 C10.2 C11.2 C12.1 C13.2 C15.2 C17.2 C18.2 C19.1 C20.2 C24.2 C25.1 C29.1 C31.1 C32.1 C34.2 C35.2 C37.1 C41.1 C46.1 C47.1 C48.1 C50.1 C51.1 C52.1 C53.1 C54.1 C55.1 C56.1 C57.1 C58.1 C59.1 C60.2 C61.1 C62.2 C63.1 C64.2 C65.1 C66.2 C67.2 C69.2 C75.1 C80.1 C81.1 C82.2 C83.1 C84.1 C85.1 C86.1 C87.1 C88.2 C90.2 C91.2 C92.2 C93.1 C94.1 C95.1 D1.2(A) D4.2(K) D8.2 D9.2(K) D10.2 D16.2 D18.2 D19.2(K) D21.2(K) D22.2 D24.2(K) D25.2 D28.2(K) D35.1 D36.1 D46.2 D48.2(K) D56.2 D58.2(K) D61.1 D63.1 D95.2 D96.2(K) D99.2 D100.2 D101.2 K1.8 L9.1 P2.2 P7.15 P7.16 P9.2 P10.2 P15.4 P16.2 P17.2 P18.2 P19.6(1) P21.4 P22.3 P23.5 P24.2 P25.3 P26.3 P27.3 P28.3 P29.3 P30.1 P31.4 P32.4 P32.6 P32.7 Q3.2(E) Q8.2(E) Q12.2(E) Q14.2(E) Q20.2(E) R55.2 R142.1 R144.1 R147.1 R154.1 R179.2 R181.2 R193.1 R194.2 R199.1 T1.1 TP5.1 U1.2(GND) U1.6(RE) U2.2(GND) U3.3(GND) U3.5(ON/OFF) U4.6(GND) U5.2(GND) U5.6(RE) U6.2(GND) U7.1(ADJ/GND) U8.2 U8.3 U10.2 U10.3 U11.2 U11.3 U13.2 U13.3 U14.3(GND) U17.3 U18.3 U19.2(GND) U19.5(RGND) U20.3 U21.9(EM4) U21.11(EM3) U21.13(EM2) U21.15(EM1) U22.3 U23.3 U24.3 U26.3 U27.8(GND) U27.12(G#) U28.3 U29.3(GND) U30.3 U31.3(GND) U32.2 U32.3 U33.10(VSS) U33.27(VSS) U33.74(VSS) U33.99(VSS) U34.1 U34.2 U34.3 U34.4 U34.7 U36.3 U37.3 X1.2(GND)
GND_422_1: D15.2 D29.2 D31.3 D32.3 D33.2 D34.2 P11.5 U5.7(RGND)
GND_422_2: D2.3 D3.3 D7.2 D11.2 D12.2 D14.2 P34.5 U1.7(RGND)
GND_485: C36.1 C40.1 D5.2 D6.2 D30.3 P12.3 R67.2 U14.5(RGND)
VDDA: C76.2 C77.2 L10.2 U33.21(VREF+) U33.22(VDDA)
VSSA: C76.1 C77.1 L9.2 U33.20(VSSA)
485_A: C40.2 D6.1 D30.2 L5.4 P12.2 R62.2
485_B: C36.2 D5.1 D30.1 L5.3 P12.1 R62.1
+24V_M: K1.3 K1.6 P6.1 T1.3 T1.6
A+: P23.1 R146.1 U27.2(1A)
A-: P23.2 R146.2 U27.1(1B)
B+: P23.3 R152.2 U27.6(2A)
B-: P23.4 R152.1 U27.7(2B)
Bell: C33.2 P7.9 R44.2 U12.4
Bell com: C33.1 P7.8 U12.3
CAN1 H: C6.1 L1.1 P1.2 P7.12 R8.1 TVS3.1
CAN1 L: C9.1 L1.2 P1.1 P7.13 R8.2 TVS3.2
CAN2 H: C22.1 L4.3 P4.2 R20.2 TVS2.1
CAN2 L: C27.1 L4.4 P4.1 R20.1 TVS2.2
EMC-: P7.11 P8.1
ExPose: D81.2(K) P21.5 Q7.3(C)
Fault: D78.2 D79.2(K) P21.2 U24.2
Fault1: C30.2 P7.7 R32.2 U9.4
Fault1 com: C30.1 P7.6 U9.3
FDP_Enable: D106.2 D107.2(K) P32.5 R208.1 U37.2
FloOut: D72.2(K) D73.2 P19.4(3) U21.8(CAT4)
FloSY: C53.2 P19.5(2) R110.2 U21.14(COL2)
Foreward: D89.1 P25.2
FPD_BOTT: D94.1 P28.2
Hand_Pre: P7.14 R43.1 R48.1
KV85: D74.2 D76.2(K) P21.1 U22.2
LCD_RX: D35.2 P15.3 R97.1
LCD_TX: D36.2 P15.2 R98.1
NRST: C83.2 R182.1 U33.14(NRST)
off: P7.5 R39.2 R42.2 R47.2 R143.2
on/Exp: P7.3 R27.2 R31.2 R36.2
origin: D85.2 D86.2(K) P22.2 U28.2
P14 24 M: C50.2 D56.1 Q5.3(C) R95.2 T1.8
P16 P17 P18: P16.1 P17.1 P18.1 Q6.3(D)
PA3(BZ): R195.2 U33.26(PA3)
PA4(KV85): C56.2 R123.2 U22.4 U33.29(PA4)
PA5(Fault): C58.2 R130.2 U24.4 U33.30(PA5)
PA6(READY): C59.2 R139.2 U26.4 U33.31(PA6)
PA7(PRE): D75.2 D77.2(K) U23.2 U33.32(PA7)
PA8(SCL): C90.1 R190.2 U33.67(PA8) U34.6
PA11(USB D-): R187.1 U33.70(PA11)
PA12(USB D+): R188.1 U33.71(PA12)
PA13(SWDIO): P31.2 R192.2 U33.72(PA13(JTMS-SWDIO))
PA14(SWCLK): P31.3 R193.2 U33.76(PA14(JTCK-SWCLK))
PA15(EA): R162.1 U27.3(1Y) U33.77(PA15(JTDI))
PB3(EB): R156.1 U27.5(2Y) U33.89(PB3(JTDOTRACESWO))
PB4(24_M): D40.2 D41.2(K) U17.2 U33.90(PB4(NJTRST))
PB5(485 enable): U33.91(PB5)
PB6(485_TX): U14.2(TXD) U33.92(PB6)
PB7(485_RX): U14.1(RXD) U33.93(PB7)
PB8(CAN1 RX): U2.4(RXD) U33.95(PB8)
PB9(CAN1 TX): U2.3(TXD) U33.96(PB9)
PB12(CAN2_RX): U6.4(RXD) U33.51(PB12)
PB13(CAN2_TX): U6.3(TXD) U33.52(PB13)
PC0(FloOut): C55.2 R119.2 U21.10(COL4) U33.15(PC0)
PC1(RadOut): C54.2 R115.2 U21.12(COL3) U33.16(PC1)
PC2(FloSY): D68.2(K) D69.2 U21.4(CAT2) U33.17(PC2)
PC3(RadSY): D66.2(K) D67.2 U21.2(CAT1) U33.18(PC3)
PC4(ExPose): D80.2 D82.2(K) U25.2 U33.33(PC4)
PC9(SDA): C91.1 R189.2 U33.66(PC9) U34.5
PC10(TX): U19.9(TXD) U33.78(PC10)
PC11(RX): U19.8(RXD) U33.79(PC11)
PC12(TX): P29.2 U33.80(PC12)
PC13(off): C32.2 R41.2 U11.4 U33.7(PC13)
PC14(Fault1): D20.2(K) D180.2 U9.2 U33.8(PC14-OSC32_IN(PC14))
PC_RX+: D15.1 D32.2 L7.4 P11.2
PC_RX+2: D3.2 D7.1 L11.4 P34.2
PC_RX-: D29.1 D32.1 L7.3 P11.1
PC_RX-2: D3.1 D11.1 L11.3 P34.1
PC_TX+: D31.1 D33.1 L6.3 P11.4 R82.2
PC_TX+2: D2.1 D12.1 L8.3 P34.4 R81.1
PC_TX-: D31.2 D34.1 L6.4 P11.3 R82.1
PC_TX-2: D2.2 D14.1 L8.4 P34.3 R81.2
PD2(RX): P29.1 U33.83(PD2)
PD5(422-TX): U5.3(TXD) U33.86(PD5)
PD6(422-RX): U5.4(RXD) U33.87(PD6)
PD9(p16,p17,p18): D64.2 D65.2(K) U20.2 U33.56(PD9)
PD10(P14): D54.2 D57.2(K) U18.2 U33.57(PD10)
PD11(Origin): C61.2 R150.2 U28.4 U33.58(PD11)
PD14(Foreward): C63.2 R169.2 U30.4 U33.61(PD14)
PD15(Reverse): C65.2 R175.2 U32.4 U33.62(PD15)
PE2(EMC-): C31.2 R33.2 U10.4 U33.1(PE2)
PE3(Bell): D23.2 D26.2(K) U12.2 U33.2(PE3)
PE4(Pre): C34.1 R46.1 U13.4 U33.3(PE4)
PE6(Exp): C29.2 R30.2 U8.4 U33.5(PE6)
PE13(SYNC OUT): C93.2 R203.2 U33.44(PE13) U36.4
PE14(FDP_Enable): C94.2 R207.2 U33.45(PE14) U37.4
PE15(SYNC_IN): D102.2 D103.2(K) R198.1 U33.46(PE15) U35.2
PRE: C57.2 P21.6 R125.2 U23.4
RadOut: D17.2 D70.2(K) P19.2(5) U21.6(CAT3)
RadSY: C52.2 P19.3(4) R105.2 U21.16(COL1)
READY: D83.2 D84.2(K) P21.3 U26.2
Reverse: D93.1 P27.2
RunLed: D98.2(K) U33.65(PC8)
SF1+: P24.1 Q9.3(C)
SF2+: P24.3 Q10.3(C)
SYNC OUT: D104.2 D105.2(K) P32.3 R204.1 U36.2
SYNC_IN_N: P32.2 Q14.3(C)
SYNC_IN_p: P32.1 R199.2 R201.2 U35.3
Tube_Bott: D90.1 P26.2
USART3_RX: U1.4(RXD) U33.48(PB11)
USART3_TX: U1.3(TXD) U33.47(PB10)
VCC out: P19.1(6) P20.2 R105.1 R110.1
XCLKIN: R2.1 U33.12(PH0-OSC_IN(PH0))
NetB1_1: B1.1 D111.2 Q20.3(C)
NetC14_1: C14.1 U4.1(CB)
NetC14_2: C14.2 D10.1 L3.1 U4.8(VSW)
NetC41_2: C41.2 R75.2 R78.2 U17.4
NetC46_2: C46.2 D46.1 K1.1 Q4.3(C) R83.2
NetC47_2: C47.2 R89.2 R93.2 U18.4
NetC51_2: C51.2 R101.2 R103.2 U20.4
NetC82_1: C82.1 U33.73(VCAP_2)
NetC84_2: C84.2 U33.49(VCAP_1)
NetD4_1: D4.1(A) R1.1
NetD8_1: D8.1 L2.1 U3.2(VOUT)
NetD9_1: D9.1(A) R15.1
NetD16_1: D16.1 R27.1 R31.1 U8.1
NetD17_1: D17.1 R113.1 R114.1 U21.5(AN3)
NetD18_1: D18.1 R29.1 R35.1 U10.1
NetD19_1: D19.1(A) R36.1
NetD20_1: D20.1(A) R37.1
NetD21_1: D21.1(A) R38.1
NetD22_1: D22.1 R39.1 R42.1 U11.1
NetD23_1: D23.1 R40.1 R45.1 U12.1
NetD24_1: D24.1(A) R47.1
NetD25_1: D25.1 R43.2 R48.2 U13.1
NetD26_1: D26.1(A) R49.1
NetD28_1: D28.1(A) R56.1
NetD40_1: D40.1 R71.1 R74.1 U17.1
NetD41_1: D41.1(A) R76.1
NetD47_1: D47.1 K1.4 K1.5 P13.1
NetD48_1: D48.1(A) R83.1
NetD54_1: D54.1 R86.1 R88.1 U18.1
NetD57_1: D57.1(A) R92.1
NetD58_1: D58.1(A) R95.1
NetD61_2: D61.2 R97.2 U19.3(T_OUT)
NetD63_2: D63.2 R98.2 U19.4(R_IN)
NetD64_1: D64.1 R99.1 R102.1 U20.1
NetD65_1: D65.1(A) R104.1
NetD66_1: D66.1(A) R108.1
NetD67_1: D67.1 R106.1 R107.1 U21.1(AN1)
NetD68_1: D68.1(A) R112.1
NetD69_1: D69.1 R109.1 R111.1 U21.3(AN2)
NetD70_1: D70.1(A) R116.1
NetD72_1: D72.1(A) R120.1
NetD73_1: D73.1 R117.1 R118.1 U21.7(AN4)
NetD74_1: D74.1 R121.1 R124.1 U22.1
NetD75_1: D75.1 R122.2 R126.1 U23.1
NetD76_1: D76.1(A) R127.1
NetD77_1: D77.1(A) R128.1
NetD78_1: D78.1 R129.1 R132.1 U24.1
NetD79_1: D79.1(A) R134.1
NetD80_1: D80.1 R131.2 R133.1 U25.1
NetD81_1: D81.1(A) R135.2
NetD82_1: D82.1(A) R136.1
NetD83_1: D83.1 R138.1 R140.1 U26.1
NetD84_1: D84.1(A) R141.1
NetD85_1: D85.1 R145.1 R148.1 U28.1
NetD86_1: D86.1(A) R151.1
NetD89_2: D89.2 R165.1 U29.1(A)
NetD90_2: D90.2 R168.1 U29.2(B)
NetD91_1: D91.1 R166.1 R167.1 U30.1
NetD91_2: D91.2 D92.2(K) U30.2
NetD92_1: D92.1(A) R170.1
NetD93_2: D93.2 R171.1 U31.1(A)
NetD94_2: D94.2 R174.1 U31.2(B)
NetD95_1: D95.1 R172.1 R173.1 U32.1
NetD96_1: D96.1(A) R176.1
NetD98_1: D98.1(A) R191.2
NetD99_1: D99.1 P30.4 R184.2
NetD100_1: D100.1 P30.3 R187.2
NetD101_1: D101.1 P30.2 R188.2
NetD102_1: D102.1 R197.1 U35.1
NetD103_1: D103.1(A) R200.1
NetD104_1: D104.1 R202.1 U36.1
NetD105_1: D105.1(A) R205.1
NetD106_1: D106.1 R206.1 U37.1
NetD107_1: D107.1(A) R209.1
NetD180_1: D180.1 R28.1 R34.1 U9.1
NetF2_1: F2.1 P20.1
NetL1_3: L1.3 U2.7(CANL)
NetL1_4: L1.4 U2.6(CANH)
NetL4_1: L4.1 U6.7(CANL)
NetL4_2: L4.2 U6.6(CANH)
NetL5_1: L5.1 R58.2 U14.6(A)
NetL5_2: L5.2 R67.1 U14.7(B)
NetL6_1: L6.1 U5.10(B)
NetL6_2: L6.2 U5.11(A)
NetL7_1: L7.1 U5.8(Y)
NetL7_2: L7.2 U5.9(Z)
NetL8_1: L8.1 U1.10(B)
NetL8_2: L8.2 U1.11(A)
NetL11_1: L11.1 U1.8(Y)
NetL11_2: L11.2 U1.9(Z)
NetP8_2: P8.2 P33.1
NetP9_1: P9.1 P10.1 Q2.3(D) R56.2
NetP14_1: P14.1 T1.4 T1.5
NetP33_2: P33.2 R29.2 R35.2 R38.2 R54.2
NetQ2_1: Q2.1(G) R52.1 R53.2
NetQ3_1: Q3.1(B) R54.1 R55.1
NetQ3_3: Q3.3(C) R51.2 R53.1
NetQ4_1: Q4.1(B) R77.2 R78.1
NetQ5_1: Q5.1(B) R90.2 R93.1
NetQ6_1: Q6.1(G) R100.1 R101.1
NetQ7_1: Q7.1(B) R137.1 R142.2
NetQ7_2: Q7.2(E) Q8.3(C)
NetQ8_1: Q8.1(B) R143.1 R144.2
NetQ9_1: Q9.1(B) R157.1 R160.1
NetQ10_1: Q10.1(B) R158.1 R161.1
NetQ11_1: Q11.1(B) R163.1
NetQ11_2: Q11.2(E) Q12.3(C)
NetQ11_3: Q11.3(C) R160.2 R161.2
NetQ12_1: Q12.1(B) R164.1
NetQ14_1: Q14.1(B) R201.1
NetQ20_1: Q20.1(B) R194.1 R195.1
NetR2_2: R2.2 X1.3(OUTPUT)
NetR58_1: R58.1 U14.8(VO)
NetR137_2: R137.2 U25.3
NetR147_2: R147.2 U27.15(4B)
NetR149_2: R149.2 U27.14(4A)
NetR153_2: R153.2 U27.10(3A)
NetR154_2: R154.2 U27.9(3B)
NetR163_2: R163.2 R166.2 R167.2 R170.2 U29.4(Y)
NetR164_2: R164.2 R172.2 R173.2 R176.2 U31.4(Y)
NetR179_1: R179.1 U33.94(BOOT0)
NetR181_1: R181.1 U33.37(PB2-BOOT1(PB2))

Not connected (* = marked no-connect by the designer): K1 2* 7*; P24 4*; T1 2* 7*; U1 12(VO); U3 6(PAD)*; U4 2(SS)* 3(SYNC)* 5(ON/OFF#)*; U5 12(VO); U19 6(NC)* 7(NC)*; U27 11(3Y)* 13(4Y)*; U33 4(PE5)* 9(PC15-OSC32_OUT(PC15))* 13(PH1-OSC_OUT(PH1)) 23(PA0-WKUP(PA0))* 24(PA1)* 25(PA2)* 34(PC5)* 35(PB0)* 36(PB1)* 38(PE7)* 39(PE8)* 40(PE9)* 41(PE10)* 42(PE11)* 43(PE12)* 53(PB14)* 54(PB15)* 55(PD8)* 59(PD12)* 60(PD13)* 63(PC6)* 64(PC7)* 68(PA9) 69(PA10) 81(PD0)* 82(PD1)* 84(PD3)* 85(PD4)* 88(PD7)* 97(PE0)* 98(PE1)*

### Notes on the sheet
- 程序下载
- 串口
- +24_M
- 供电
- 5V转3.3V
- 422_2
- 422_1
- 485通信
- 24V转5v;12v
- USB
- CAN1
- CAN2
- 没有用上
- 232通信
- 整机接线图里没有连接p19和p20
- 按板上丝印标的
- (near P13) BrK_Power
- 控制p16;p17;p18是否接5V
- 控制P13是否接24_M电压
- (near P14) 控制P14是否接24V_M
- PB7(485_RX)  串口1
- PD5(422-TX) 串口2
- PC10(TX) 串口4
- PD2(RX) 串口5
- 控制高压板参数
- p33,p8都已经用导线连接好了
- (near P9) 输出+24v
- (near P10) 输出+24v
- 当EMC-为高时，Q2导通，P9,P10输出+24V
- r208去掉
- 探测器通信，命名与探测板说明书一致
- p28和p26的2，3通过外部导线连接
- 当转到限位角度时，u31/u29输出高电平
- 当未转到限位时，u31/u29输出低电平
- 按电路板丝印命名
- 不起作用
- (near P24) 按照电路板上丝印标的
- R157接的是24还是AGNDM
- 电路板上确实是按电路图这样接的
- 感觉三极管部分不起作用
- EEPROM
- U29和U31接地？ 这块肯定不对
- 型号不对，实际上是74AHC1G02W5，或非门
- 电机A,B相输出
- Labels drawn without touching a wire or pin: GND_422_1, PC12(TX), PD2(RX)

### Library data of the parts
B1 = QMB-09B-03: Manufacturer: 华能; Add into BOM: yes; Driver Circuitry: 无源(外部驱动); Voltage - Supply: 2V~5V; Value: 2.7kHz; Sound Pressure Level(SPL): 85dB; Symbol: QMB-09B-03; Device: QMB-09B-03; LCSC Part Name: 无源蜂鸣器QMB-09B-03; Supplier Part: C96256; Manufacturer Part: QMB-09B-03; Supplier Footprint: 插件,D=9mm; JLCPCB Part Class: Extended Part; Datasheet: https://atta.szlcsc.com/upload/public/pdf/source/20210401/C96256_958B17753B5AD7CBFBCFFC7C095B4484.pdf; Supplier: LCSC; Convert to PCB: yes; Technology: 电磁式; Diameter(φD): 9mm; Height: 5.7mm
C1 C2 C4 C6 C9 C10 C15 C17 C19 C22 C24 C27 C29-C37 C40 C41 C46-C48 C50-C65 C67 C75-C77 C80-C85 C87 C88 C90-C95 = CAP: 贴片电容 10uF/X5R/20%/6.3V; Value: 0.1uF; PCB DECAL: 0402_64X24MIL; Published: 8-Jun-2000; LatestRevisionDate: 17-Jul-2002; LatestRevisionNote: Re-released for DXP Platform.; PackageReference: RAD-0.3; Publisher: Altium Limited; Comment_1: CAP
C3 = JBLH2331M035D120RLM 330UF 35V: Add into BOM: yes; Voltage Rating: 35V; Ripple Current: 2.5A@100kHz; Symbol: JBLH2331M035D120RLM 330UF 35V; Device: JBLH2331M035D120RLM 330UF 35V; Supplier Part: C19270679; Manufacturer Part: JBLH2331M035D120RLM 330UF 35V; JLCPCB Part Class: Extended Part; Datasheet: https://atta.szlcsc.com/upload/public/pdf/source/20240115/A8AEE34F18141ED8ECDC768830B190B9.pdf; Supplier: LCSC; Convert to PCB: yes; Value: 330uF
C5 = CAP: Capacitor
C7 C8 C12 C14 C25 = CAP: PCB DECAL: 0402_64X24MIL; Published: 8-Jun-2000; LatestRevisionDate: 17-Jul-2002; LatestRevisionNote: Re-released for DXP Platform.; PackageReference: RAD-0.3; Publisher: Altium Limited; Comment_1: CAP
  C7 C8: Value: 22uf/25v
  C12 C25: Value: 1uf/25v
  C14: Value: 0.1uF
C11 C18 C20 = Cap Pol1: Polarized Capacitor (Radial); Value: 100pF; Published: 8-Jun-2000; LatestRevisionDate: 17-Jul-2002; LatestRevisionNote: Re-released for DXP Platform.; PackageReference: RB7.6-15; Publisher: Altium Limited
C13 = ORZ102M1CBK-1012: Add into BOM: yes; Voltage Rating: 16V; Ripple Current: 6.1A@100kHz; Pin Spacing: 5mm; Symbol: ORZ102M1CBK-1012; Device: ORZ102M1CBK-1012; Supplier Part: C134869; Manufacturer Part: ORZ102M1CBK-1012; JLCPCB Part Class: Extended Part; Datasheet: https://atta.szlcsc.com/upload/public/pdf/source/20191223/C473430_52B8CA4249628331E66A6AEB4F16AD74.pdf; Supplier: LCSC; Convert to PCB: yes; Value: 1000uF; Equivalent Series Resistance(ESR): -; Type: -; Diameter: 10mm; Height - Seated (Max): 12mm
C66 C69 C86 = CAP: Value: 0.1uF; PCB DECAL: 0402_64X24MIL; Published: 8-Jun-2000; LatestRevisionDate: 17-Jul-2002; LatestRevisionNote: Re-released for DXP Platform.; PackageReference: RAD-0.3; Publisher: Altium Limited; Comment_1: CAP
D1 = SS34_C8678: Add into BOM: yes; Forward Voltage (Vf@If): 550mV@3A; Reverse Voltage (Vr): 40V; Rectified Current: 3A; Reverse Leakage Current (Ir): 500uA@40V; Symbol: SS34_C8678; Device: SS34_C8678; Supplier Part: C8678; Manufacturer Part: SS34; Supplier Footprint: SMA(DO-214AC); JLCPCB Part Class: Basic Part; Datasheet: https://atta.szlcsc.com/upload/public/pdf/source/20240710/2118BB86FDDB2E0B294389AC1F3F65C8.pdf; Supplier: LCSC; Convert to PCB: yes
D2 D3 D30-D32 = TPSM712: Add into BOM: yes; Symbol: TPSM712; Device: TPSM712; LCSC Part Name: TPSM712; Supplier Part: C521948; Manufacturer Part: TPSM712; Supplier Footprint: SOT-23; JLCPCB Part Class: Extended Part; Datasheet: https://atta.szlcsc.com/upload/public/pdf/source/20210810/BB2F993610C46A181A7AAE5D09884DEF.pdf; Supplier: LCSC; Convert to PCB: yes
D4 D9 D19-D21 D24 D26 D66 D68 D70 D72 D77 D86 D92 D96 D98 = GREEN LED: LED; Value: GREEN
D5-D7 D11 D12 D14 D15 D29 D33-D36 = SMB90XM: Add into BOM: yes; Number of Poles: 2; Voltage - DC Spark Over (Nom): 90V; Impulse Discharge Current: 500A; inter-electrode capacitance: 0.5pF; Symbol: SMB90XM; Device: SMB90XM; Supplier Part: C527147; Manufacturer Part: SMB90XM; Supplier Footprint: 1206; JLCPCB Part Class: Extended Part; Datasheet: https://atta.szlcsc.com/upload/public/pdf/source/20200508/C527150_F0D53D7FAFC2AA44B5719B72ADFAED31.pdf; Supplier: LCSC; Convert to PCB: yes
D8 D10 D16-D18 D22 D23 D25 D40 D46 D47 D54 D56 D64 D67 D69 D73-D75 D78 D80 D83 D85 D89-D91 D93-D95 D102 D104 D106 D111 D180 = D_TH_FR104: code: *
D28 D41 D48 D57 D58 D65 D76 D79 D81 D82 D84 D103 D105 D107 = GREEN LED: Value: GREEN
D61 D63 = SMAJ15CA_C223985: Add into BOM: yes; Reverse Stand-Off Voltage (Vrwm): 15V; Maximum Clamping Voltage: 24.4V; Peak Pulse Current (Ipp): 16.4A; Peak Pulse Power Dissipation (Ppp): 400W; Breakdown Voltage: 16.7V; Type: TVS; Symbol: SMAJ15CA_C223985; Device: SMAJ15CA_C223985; Supplier Part: C223985; Manufacturer Part: SMAJ15CA; Supplier Footprint: SMA(DO-214AC); JLCPCB Part Class: Extended Part; Datasheet: https://atta.szlcsc.com/upload/public/pdf/source/20190402/C374025_5ACE77BC72947DF13CF0CBC7F8B57228.pdf; Supplier: LCSC; Convert to PCB: yes
D99-D101 = BV05C-MS: Add into BOM: yes; Reverse Stand-Off Voltage (Vrwm): 5V; Maximum Clamping Voltage: 18V; Peak Pulse Current (Ipp)@10/1000us: 18A; Breakdown Voltage: 6V; Type: ESD; Symbol: BV05C-MS; Device: BV05C-MS; LCSC Part Name: BV05C-MS; Supplier Part: C2836312; Manufacturer Part: BV05C-MS; Supplier Footprint: SOD-323; JLCPCB Part Class: Extended Part; Datasheet: https://atta.szlcsc.com/upload/public/pdf/source/20210623/C2836312_E7C28A142771005E4B552290D731AC83.pdf; Supplier: LCSC; Convert to PCB: yes
F1 F2 = Fuse 2: Fuse; Published: 8-Jun-2000; LatestRevisionDate: 17-Jul-2002; LatestRevisionNote: Re-released for DXP Platform.; PackageReference: PIN-W2/E2.8; Publisher: Altium Limited
K1 = G2R-2-DC5: Add into BOM: yes; Coil Voltage: 5V; Maximum Switching Current: 5A; Operate Time: 15ms; Release Time: 5ms; Symbol: G2R-2-DC5; Device: G2R-2-DC5; LCSC Part Name: G2R-2-DC5; Supplier Part: C469145; Manufacturer Part: G2R-2-DC5; Supplier Footprint: DIP,12.7x28.8mm; JLCPCB Part Class: Extended Part; Supplier: LCSC; Convert to PCB: yes; Pin Number: -; Contact Rating: -; Coil Type: -; Coil Resistance: -; Contact Resistance: -
L1 L4-L8 L11 = ACT45B-510-2P-TL003: Manufacturer: TDK; Add into BOM: yes; Number of Lines: 2; Withstanding Voltage: 250V@2secs; Current Rating: 200mA; Inductance @ Frequency: 51uH@100kHz; Voltage Rating - DC: 50V; Symbol: ACT45B-510-2P-TL003; Device: ACT45B-510-2P-TL003; Supplier Part: C76584; Manufacturer Part: ACT45B-510-2P-TL003; Supplier Footprint: SMD,4.5x3.2mm; JLCPCB Part Class: Extended Part; Datasheet: https://atta.szlcsc.com/upload/public/pdf/source/20160918/1474166842057.pdf; Supplier: LCSC; Convert to PCB: yes; Voltage Rating: -
L2 L3 = Inductor: Code_IEC: 1005; Value: 10mH; Published: 8-Jun-2000; LatestRevisionDate: 17-Jul-2002; LatestRevisionNote: Re-released for DXP Platform.; PackageReference: 0402-A; Publisher: Altium Limited; Code_JEITA: 0402
L9 L10 = BPH853025R5-101T: 标称阻抗@测试频率:100Ω@100MHz;误差:±25%;直流电阻(RDC):1mΩ;; Manufacturer: TAI-TECH(台庆); Add into BOM: yes; Tolerance: ±25%; DC Resistance: 1mΩ; Current Rating: 30A; Circuits: 1; Symbol: BPH853025R5-101T; Device: BPH853025R5-101T; LCSC Part Name: 单路 贴片磁珠 阻抗100Ω@100MHz; Supplier Part: C2880046; Manufacturer Part: BPH853025R5-101T; Supplier Footprint: SMD,9x3mm; JLCPCB Part Class: 扩展库; Datasheet: https://atta.szlcsc.com/upload/public/pdf/source/20210825/19F9B848C4EFEC47B279581DC391746A.pdf; Supplier: LCSC; Convert to PCB: yes; Impedance @ Frequency: 100Ω@100MHz; Comment_1: BPH853025R5-101T
P1 P4 P12 P20 P22 P25-P29 = Header 3: Header, 3-Pin; LatestRevisionDate: 17-Jul-2002; LatestRevisionNote: Re-released for DXP Platform.; Publisher: Altium Limited
P2 P6 P8-P10 P13 P14 P16-P18 P33 = Header 2: Header, 2-Pin; LatestRevisionDate: 17-Jul-2002; LatestRevisionNote: Re-released for DXP Platform.; Publisher: Altium Limited
P7 = Header 16: Header, 16-Pin; LatestRevisionDate: 17-Jul-2002; LatestRevisionNote: Re-released for DXP Platform.; Publisher: Altium Limited
P11 P23 P34 = Header 5: Header, 5-Pin; LatestRevisionDate: 17-Jul-2002; LatestRevisionNote: Re-released for DXP Platform.; Publisher: Altium Limited
P15 P30 P31 = Header 4: Header, 4-Pin; LatestRevisionDate: 17-Jul-2002; LatestRevisionNote: Re-released for DXP Platform.; Publisher: Altium Limited
P19 = Header 6: Header, 6-Pin; LatestRevisionDate: 17-Jul-2002; LatestRevisionNote: Re-released for DXP Platform.; Publisher: Altium Limited
P21 P32 = Header 7: Header, 7-Pin; LatestRevisionDate: 17-Jul-2002; LatestRevisionNote: Re-released for DXP Platform.; Publisher: Altium Limited
P24 = Header 4H: Header, 4-Pin, Right Angle; LatestRevisionDate: 17-Jul-2002; LatestRevisionNote: Re-released for DXP Platform.; Publisher: Altium Limited
Q2 Q6 = NCE3415: Add into BOM: yes; Drain to Source Voltage: 20V; Current - Continuous Drain(Id): 4A; Pd - Power Dissipation: 1.4W; Input Capacitance(Ciss@Vds): 950pF@10V; Reverse Transfer Capacitance (Crss@Vds): 120pF; Symbol: NCE3415; Device: NCE3415; Supplier Part: C169820; Manufacturer Part: NCE3415; Supplier Footprint: SOT-23; JLCPCB Part Class: Extended Part; Datasheet: https://atta.szlcsc.com/upload/public/pdf/source/20180125/C169820_15168663882091303237.pdf; Supplier: LCSC; Convert to PCB: yes; Gate Threshold Voltage (Vgs(th)@Id): -; Gate Charge(Qg): -
Q3 Q7 Q8 Q11 Q12 Q14 = MMBT8050C(1.5A): Add into BOM: yes; Transistor Type: NPN; Collector Current (Ic): 1.5A; Collector-Emitter Breakdown Voltage (Vceo): 25V; Power Dissipation (Pd): 350mW; DC Current Gain (hFE@Ic,Vce): 100@100mA,1V; Transition Frequency (fT): 120MHz; Collector Cut-Off Current (Icbo): 100nA; Collector-Emitter Saturation Voltage (VCE(sat)@Ic,Ib): 500mV@800mA,80mA; Name: MMBT8050C(1.5A); Symbol: MMBT8050; Device: MMBT8050C(1.5A); Supplier Part: C84814; Manufacturer Part: MMBT8050C(1.5A); Supplier Footprint: SOT-23; JLCPCB Part Class: Extended Part; Datasheet: https://atta.szlcsc.com/upload/public/pdf/source/20170719/C118742_1500457798594828447.pdf; Supplier: LCSC; Convert to PCB: yes; Operating Temperature: -
Q4 Q5 Q9 Q10 = S8550_C20069126: Manufacturer: 宏迦橙; Add into BOM: yes; Transistor Type: PNP; Collector Current (Ic): 500mA; Collector-Emitter Breakdown Voltage (Vceo): 25V; Power Dissipation (Pd): 300mW; DC Current Gain (hFE@Ic,Vce): 120@500mA,1.0V; Transition Frequency (fT): 150MHz; Collector Cut-Off Current (Icbo): 100nA; Collector-Emitter Saturation Voltage (VCE(sat)@Ic,Ib): 500mV@1.0A,50mA; Symbol: S8550_C20069126; Device: S8550_C20069126; LCSC Part Name: hFE:200-350，丝印:2TY; Supplier Part: C20069126; Manufacturer Part: S8550; Supplier Footprint: SOT-23; JLCPCB Part Class: Extended Part; Datasheet: https://atta.szlcsc.com/upload/public/pdf/source/20231229/A44F382554E15234B24C32D7C3971EED.pdf; Supplier: LCSC; Convert to PCB: yes; Operating Temperature: -55℃~+150℃
Q20 = S8050_C20069125: Add into BOM: yes; type: NPN; Current - Collector(Ic): 500mA; Collector - Emitter Voltage VCEO: 25V; Pd - Power Dissipation: 300mW; DC Current Gain: 120@50mA,1.0V; Transition frequency(fT): 100MHz; Current - Collector Cutoff: 100nA; Vce Saturation(VCE(sat)): 600mV; Symbol: S8050_C20069125; Device: S8050_C20069125; Supplier Part: C20069125; Manufacturer Part: S8050; Supplier Footprint: SOT-23; JLCPCB Part Class: Extended Part; Datasheet: https://atta.szlcsc.com/upload/public/pdf/source/20250107/343E8B94B5C24D0D65D7D4B70E0B73F6.pdf; Supplier: LCSC; Convert to PCB: yes
R1 R8 R15 R20 R27-R49 R51-R56 R58 R62 R67 R71 R74-R78 R81-R83 R86 R88-R90 R92 R93 R95 R97-R154 R156-R158 R160-R176 R179 R181 R182 R184 R187-R193 R197-R209 = Res2: Resistor; Value: 1K; Published: 8-Jun-2000; LatestRevisionDate: 17-Jul-2002; LatestRevisionNote: Re-released for DXP Platform.; PackageReference: AXIAL-0.4; Publisher: Altium Limited
R2 = RES: Resistance: 10R
R194 R195 = Res Semi: Semiconductor Resistor; Value: 1K; Published: 8-Jun-2000; LatestRevisionDate: 17-Jul-2002; LatestRevisionNote: Re-released for DXP Platform.; PackageReference: AXIAL-0.5; Publisher: Altium Limited; PackageDescription: Axial Device, Thru-Hole; 2 Leads; 0.5 in Pin Spacing
T1 = Header 6X2: Header, 6-Pin, Dual row; LatestRevisionDate: 17-Jul-2002; LatestRevisionNote: Re-released for DXP Platform.; Publisher: Altium Limited
TP2-TP5 = RH-5001: Manufacturer: 荣和; Add into BOM: yes; Connector Type: 插针型(穿板); Plastic Color: 黑色; Board Space (Diameter φ/ Length x Width): 2.5mm; Symbol: RH-5001; Device: RH-5001; LCSC Part Name: PCB电路板测试点/测试针; Supplier Part: C5199801; Manufacturer Part: RH-5001; Supplier Footprint: -; JLCPCB Part Class: Extended Part; Datasheet: https://atta.szlcsc.com/upload/public/pdf/source/20240125/4C7D900D13ECC10386B63F24462DBAAB.pdf; Supplier: LCSC; Convert to PCB: yes
TVS2 TVS3 = CAN_TVS_NUP2015L
U1 U5 = RSM3422_C7425471: Add into BOM: yes; Data Rate(Max): 10Mbps; Symbol: RSM3422_C7425471; Device: RSM3422_C7425471; Supplier Part: C7425471; Manufacturer Part: RSM3422; Supplier Footprint: DIP; JLCPCB Part Class: Extended Part; Datasheet: https://atta.szlcsc.com/upload/public/pdf/source/20230612/6B49E764D559F213AF9D155AFC53A5E8.pdf; Supplier: LCSC; Convert to PCB: yes
U2 U6 = CTM1051KAT: Manufacturer: VISOM; Symbol: CTM1051KAT_C882111; Add into BOM: yes; Data Rate: 1Mbps; Voltage - Supply: 3.3V; Quiescent Current: 30mA; Device: CTM1051KAT; Supplier Part: C882111; Manufacturer Part: CTM1051KAT; Supplier Footprint: DIP-7; JLCPCB Part Class: Extended Part; Datasheet: https://atta.szlcsc.com/upload/public/pdf/source/20201026/C882111_FB58A007DF242ED318148B1AB4BC44C7.pdf; Supplier: LCSC; Convert to PCB: yes
U3 = LM2576HVR-5.0: Manufacturer: HTC; Add into BOM: yes; Input Voltage: 60V; Output Voltage: 5V; Output Current: 3A; Switching Frequency: 52kHz; Number of Outputs: 1; Symbol: LM2576HVR-5.0; Device: LM2576HVR-5.0; LCSC Part Name: LM2576HVR-5.0; Supplier Part: C2071507; Manufacturer Part: LM2576HVR-5.0; Supplier Footprint: TO-263-5; JLCPCB Part Class: Extended Part; Datasheet: https://atta.szlcsc.com/upload/public/pdf/source/20191203/C126037_E42ABC3D16C6AA3446C45CA7229A4210.pdf; Supplier: LCSC; Convert to PCB: yes
U4 = LM2672M-ADJ/NOPB: Add into BOM: yes; Input Voltage: 8V~40V; Output Voltage: 1.21V~37V; Output Current: 1A; Switching Frequency: 260kHz; Number of Outputs: 1; Quiescent Current (Iq): 50uA; Symbol: LM2672M-ADJ/NOPB; Device: LM2672M-ADJ/NOPB; Supplier Part: C1355329; Manufacturer Part: LM2672M-ADJ/NOPB; Supplier Footprint: SOIC-8; JLCPCB Part Class: Extended Part; Datasheet: https://www.ti.com/cn/lit/gpn/lm2672; Supplier: LCSC; Convert to PCB: yes; Synchronous Rectification: -
U7 = TLV1117LV33DCYR: Add into BOM: yes; Maximum Input Voltage: 5.5V; Output Voltage: 3.3V; Output Current: 1A; Power Supply Rejection Ratio (PSRR): 75dB@(120Hz); Dropout Voltage: 1.3V@(800mA); standby current: 100uA; Number of Outputs: 1; Symbol: TLV1117LV33DCYR; Device: TLV1117LV33DCYR; Supplier Part: C15578; Manufacturer Part: TLV1117LV33DCYR; Supplier Footprint: SOT-223; JLCPCB Part Class: Extended Part; Datasheet: https://www.ti.com/cn/lit/gpn/tlv1117lv; Supplier: LCSC; Convert to PCB: yes
U8-U13 U17 U18 U20 U22-U26 U28 U30 U32 U35-U37 = LTV-217-C-G: Add into BOM: yes; Input voltage type: DC; Forward Voltage: 1.2V; Output Current: 50mA; Isolation Voltage(rms): 3.75kV; Reverse Voltage: 6V; Receiving End Voltage: 80V; Number of Outputs: 1; Collector-Emitter Saturation Voltage (Vce(sat)@Ic,IF): 400mV@2.4mA,8mA; Symbol: LTV-217-C-G; Device: LTV-217-C-G; Supplier Part: C123196; Manufacturer Part: LTV-217-C-G; Supplier Footprint: SOP-4-175mil; JLCPCB Part Class: Extended Part; Datasheet: https://atta.szlcsc.com/upload/public/pdf/source/20170930/C133123_1506736378617997371.pdf; Supplier: LCSC; Convert to PCB: yes
U14 = TD301M485: Manufacturer: VISOM; Add into BOM: yes; Data Rate: 500Kbps; Voltage - Supply: 3.15V~3.45V; isolation: 2500V; Number of Nodes: 64; Quiescent Current: 22mA; Symbol: TD301M485; Device: TD301M485; LCSC Part Name: 500Kbps 64; Supplier Part: C2682606; Manufacturer Part: TD301M485; Supplier Footprint: DIP-8; JLCPCB Part Class: Extended Part; Datasheet: https://atta.szlcsc.com/upload/public/pdf/source/20210105/C2682606_F1AD21272F430052E64FB3724D643821.pdf; Supplier: LCSC; Convert to PCB: yes
U19 = TD331S232H: Add into BOM: yes; Symbol: TD331S232H; Device: TD331S232H; Supplier Part: C2856296; Manufacturer Part: TD331S232H; Supplier Footprint: SMD-12P; JLCPCB Part Class: Extended Part; Datasheet: https://atta.szlcsc.com/upload/public/pdf/source/20210818/C2856296_2F451797A6F54FEF5ADB800091E59333.pdf; Supplier: LCSC; Convert to PCB: yes
U21 = LTV-247: Add into BOM: yes; Input voltage type: DC; Forward Voltage: 1.2V; Output Current: 50mA; Isolation Voltage(rms): 3.75kV; Reverse Voltage: 6V; Load Voltage: 80V; Number of Outputs: 4; Collector-Emitter Saturation Voltage (Vce(sat)@Ic,IF): 400mV@2.4mA,8mA; Symbol: LTV-247; Device: LTV-247; Supplier Part: C115451; Manufacturer Part: LTV-247; Supplier Footprint: SOP-16-5.4mm; JLCPCB Part Class: Extended Part; Datasheet: https://atta.szlcsc.com/upload/public/pdf/source/20230919/3E7196EE6DB375F3BC93510F75354615.pdf; Supplier: LCSC; Convert to PCB: yes
U27 = AM26LV32CDR: Add into BOM: yes; Number of Driver: 0; Number of receiver: 4; Supply Voltage: 3V~3.6V; Symbol: AM26LV32CDR; Device: AM26LV32CDR; Supplier Part: C363278; Manufacturer Part: AM26LV32CDR; Supplier Footprint: SOP-16; JLCPCB Part Class: Extended Part; Datasheet: https://www.ti.com/cn/lit/gpn/am26lv32; Supplier: LCSC; Convert to PCB: yes
U29 U31 = 74AHC1G02GV: Add into BOM: yes; Symbol: 74AHC1G02GV; Device: 74AHC1G02GV; LCSC Part Name: 74AHC1G02GV; Supplier Part: C41348121; Manufacturer Part: 74AHC1G02GV; Supplier Footprint: SOT-23-5; Datasheet: https://atta.szlcsc.com/upload/public/pdf/source/20240904/1EAF21675DBE2DD4B202BB88D1A526F3.pdf; Supplier: LCSC; Convert to PCB: yes
U33 = STM32F407VET6: Add into BOM: yes; CPU Core: ARM-M4; CPU Maximum Speed: 168MHz; Program Storage Size: 512KB; Program Memory Type: FLASH; Number of I/O: 82; ADC (Bit): 12bit; Low Voltage Detection Threshold: 1.8V~3.6V; Symbol: STM32F407VET6; Device: STM32F407VET6; Supplier Part: C28730; Manufacturer Part: STM32F407VET6; Supplier Footprint: LQFP-100(14x14); JLCPCB Part Class: Extended Part; Datasheet: https://atta.szlcsc.com/upload/public/pdf/source/20140801/1457707197138.pdf; Supplier: LCSC; Convert to PCB: yes; DAC (Bit): 12bit; Application Area: -
U34 = Header 4X2A: Header, 4-Pin, Dual row; LatestRevisionDate: 17-Jul-2002; LatestRevisionNote: Re-released for DXP Platform.; Publisher: Altium Limited
X1 = 8MHz: BOM_Manufacturer: Shenzhen SCTF Elec; nameAlias: Frequency; Contributor: LCSC; BOM_JLCPCB Part Class: Extended Part; spicePre: X